# EAGLE schematic PLC_YN_CPU (EAGLE 9.6.2)

## Sheet 1 of 7: ETAPA DE ALIMENTACIÓN
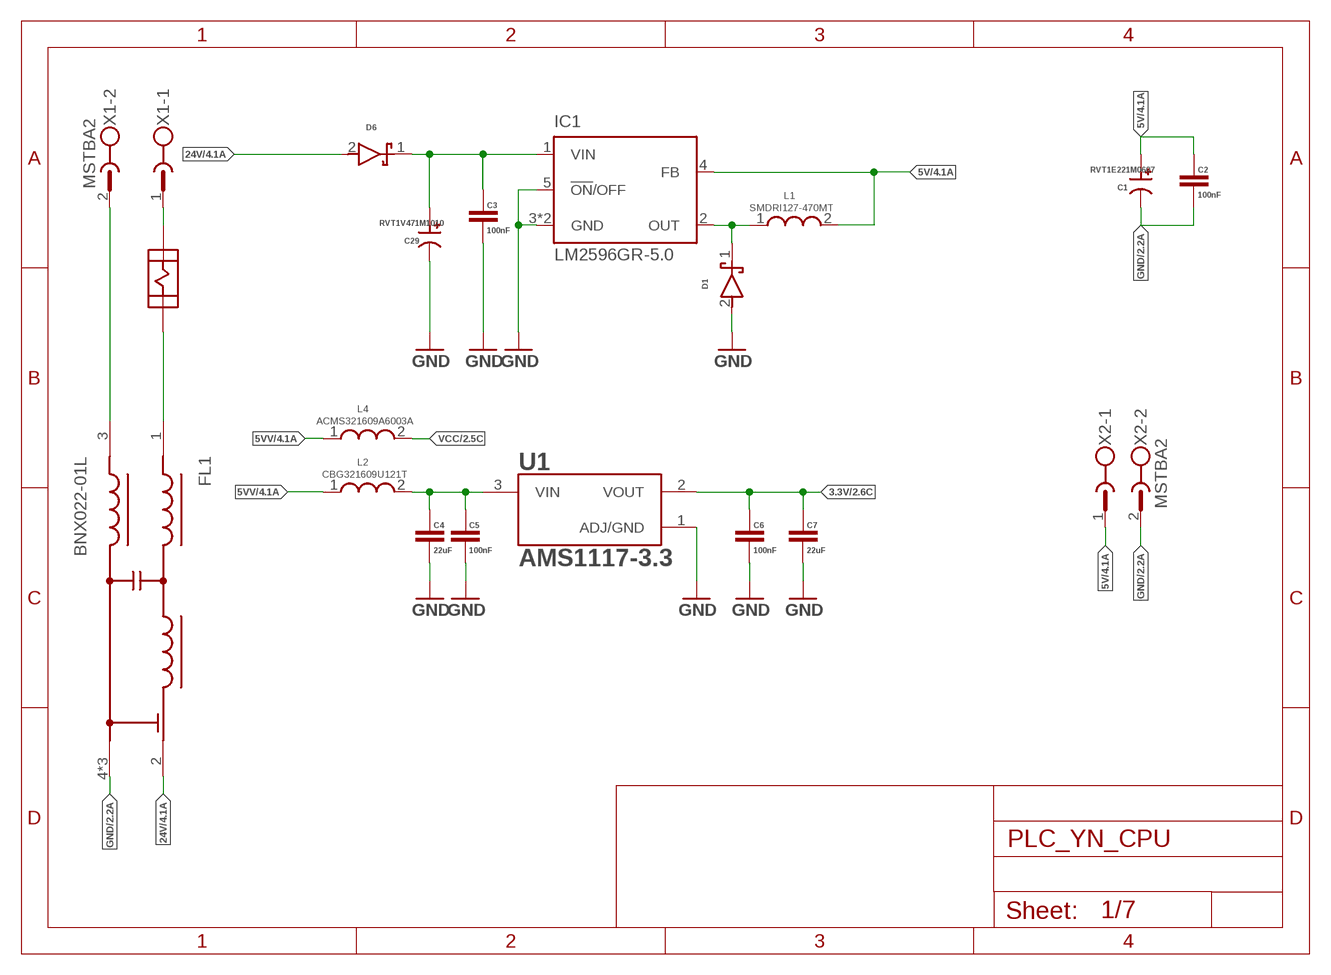
[diagram p0: schematic, sheet 1]

### Parts
C1  RVT1E221M0607  100UF_6.3X7.7_SMD  [CAP_100UF_6.3X7.7SMD]
C2  100nF  CAP_0603C0603  [C0603]
C3  100nF  CAP_0603C0603  [C0603]
C4  22uF  CAP_1206  [SMD_1206]
C5  100nF  CAP_0603C0603  [C0603]
C6  100nF  CAP_0603C0603  [C0603]
C7  22uF  CAP_1206  [SMD_1206]
C29  RVT1V471M1010  470UF_10X10.2_SMD  [CAP_470UF_SMD_10X10.2]
D1  SS36F  B360B-13-F  [B360]
D6  SS56  B360B-13-F  [B360]
F2  3A  PORTAFUSIBLE  [PORTAFUSIBLE]
FL1  BNX022-01L  [FIL_BNX022-01L]
IC1  LM2596GR-5.0  LM2596S  [TO263-5]
L1  SMDRI127-470MT  INDUCTOR_SMD  [IND]
L2  CBG321609U121T  FERRITA_SMD_1206  [SMD_1206]
L4  ACMS321609A6003A  FERRITA_SMD_1206  [SMD_1206]
U1  AMS1117-3.3  [SOT229P700X180-4N]
X1  MSTBA2  [MSTBA2]
X2  MSTBA2  [MSTBA2]

### Nets
3.3V: C6.1 C7.1 U1.2(VOUT) ; also sheet 2,5
5V: C1.P C2.1 IC1.4(FB) L1.2 X2.1 ; also sheet 4
5VV: L2.1 L4.1 ; also sheet 4
24V: D6.2 FL1.2(CB) ; also sheet 4
GND: C1.N C2.2 C3.2 C4.2 C5.2 C6.2 C7.2 C29.N D1.2 FL1.4(CG) FL1.5(CG) FL1.6(CG) IC1.3(GND) IC1.5(!ON!/OFF) IC1.6(GND) U1.1(ADJ/GND) X2.2 ; also sheet 2,3,4,5,6,7
N$1: C4.1 C5.1 L2.2 U1.3(VIN)
N$4: C3.1 C29.P D6.1 IC1.1(VIN)
N$7: D1.1 IC1.2(OUT) L1.1
N$23: F2.P$2 F2.P$4 X1.1
N$29: FL1.3(PSG) X1.2
N$39: F2.P$1 F2.P$3 FL1.1(B)
VCC: L4.2 ; also sheet 2,3,7

## Sheet 2 of 7: MCU STM32F446
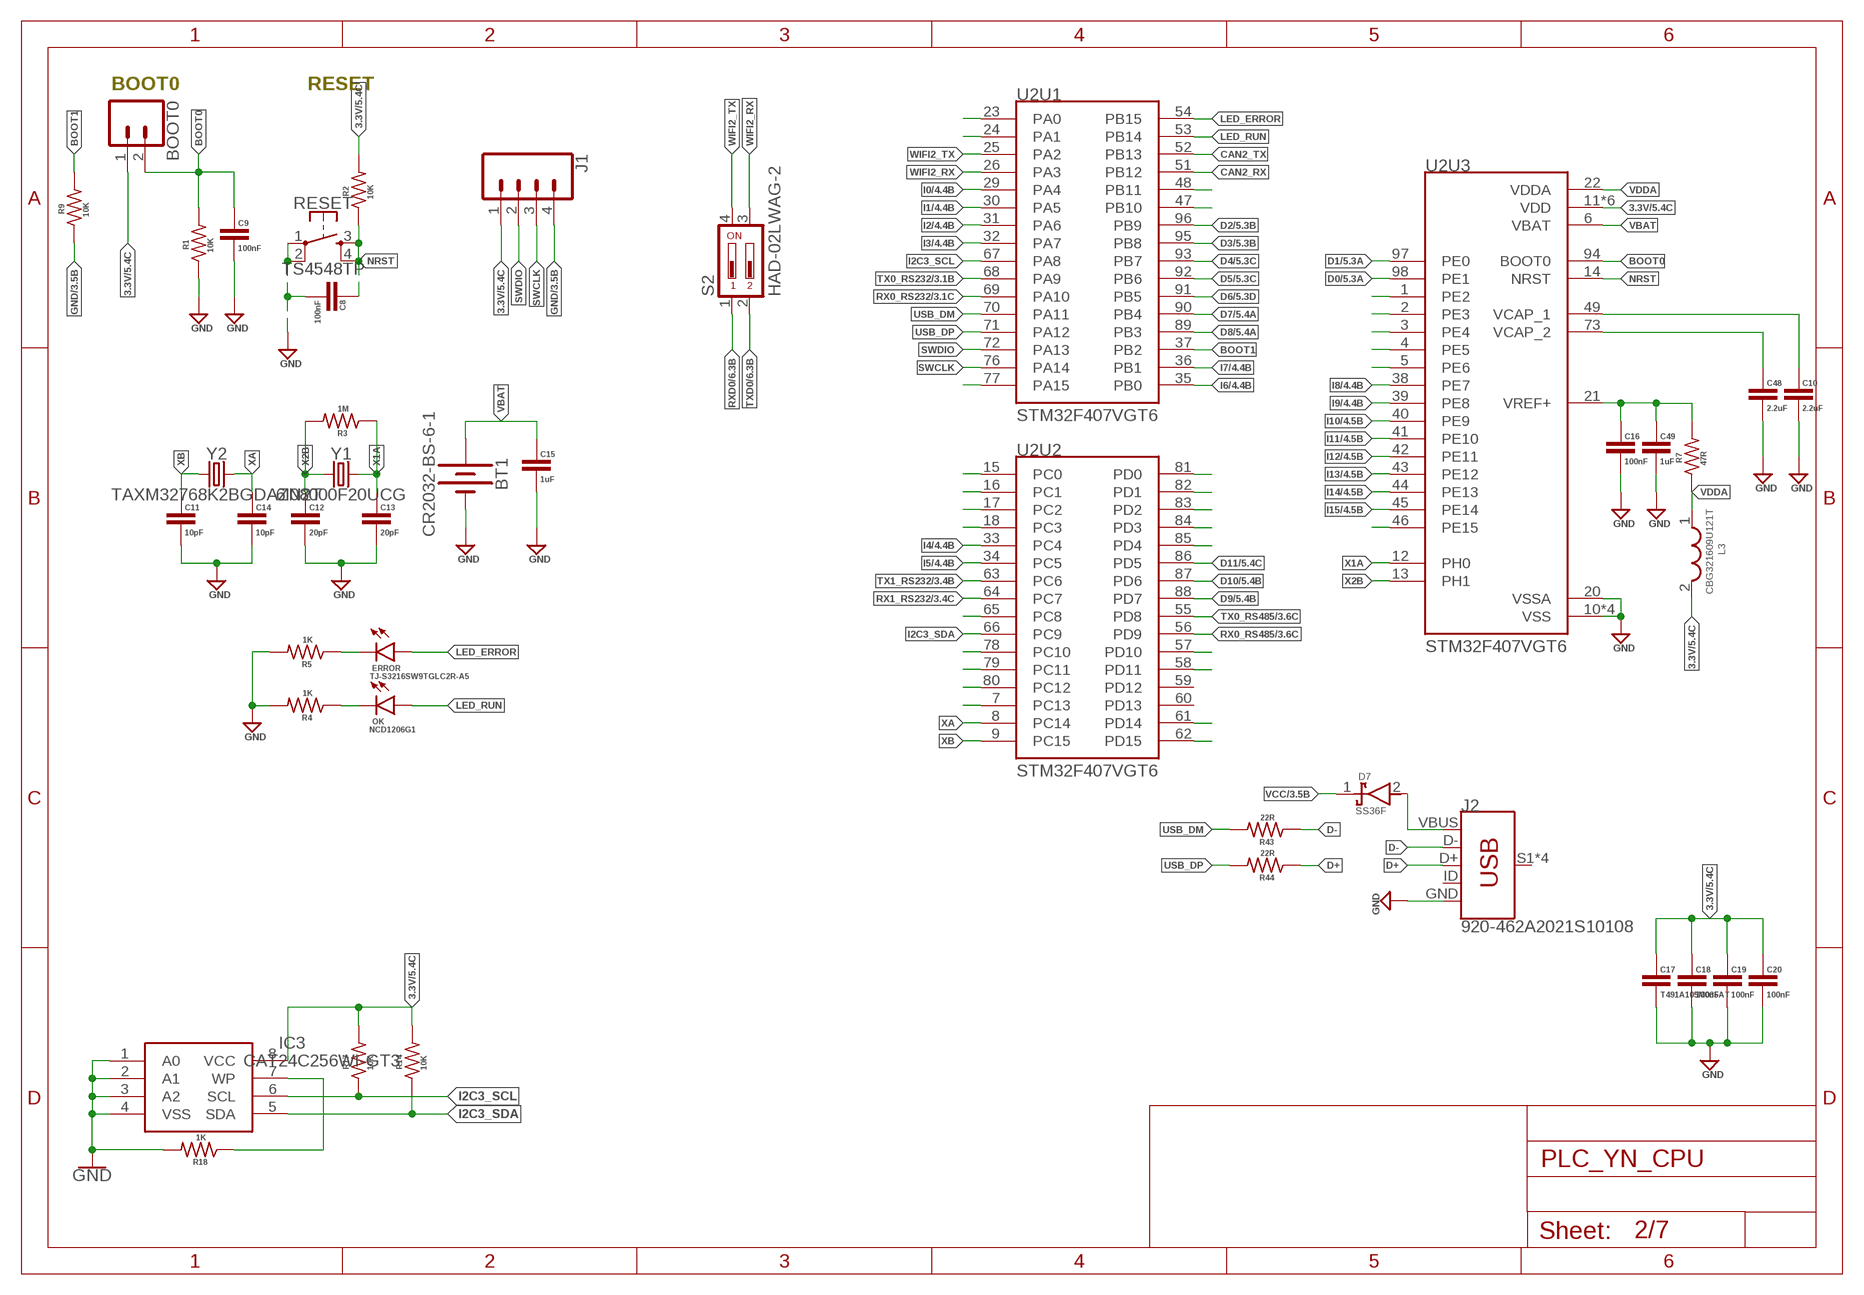
[diagram p1: schematic, sheet 2]

### Parts
BOOT0  CONN_02  [1X02]
BT1  CR2032-BS-6-1  BATTERY  [BAT_CR2032_SMD]
C8  100nF  CAP_0603C0603  [C0603]
C9  100nF  CAP_0603C0603  [C0603]
C10  2.2uF  CAP_0603C0603  [C0603]
C11  10pF  CAP_0603C0603  [C0603]
C12  20pF  CAP_0603C0603  [C0603]
C13  20pF  CAP_0603C0603  [C0603]
C14  10pF  CAP_0603C0603  [C0603]
C15  1uF  CAP_1206  [SMD_1206]
C16  100nF  CAP_0603C0603  [C0603]
C17  T491A105M035AT  CAP_1206  [SMD_1206]
C18  100nF  CAP_0603C0603  [C0603]
C19  100nF  CAP_0603C0603  [C0603]
C20  100nF  CAP_0603C0603  [C0603]
C48  2.2uF  CAP_0603C0603  [C0603]
C49  1uF  CAP_0603C0603  [C0603]
D7  SS36F  B360B-13-F  [B360]
ERROR  TJ-S3216SW9TGLC2R-A5  LEDSMT1206  [L1206]
IC3  CAT24C256WI-GT3  EEPROM-I2CSMD  [SO08]
J1  CONN_04  [1X04]
J2  920-462A2021S10108  USB_MINI-B_SMT  [USB-MINIB]
L3  CBG321609U121T  FERRITA_SMD_1206  [SMD_1206]
OK  NCD1206G1  LEDSMT1206  [L1206]
R1  10K  RES_0603R0603  [R0603]
R2  10K  RES_0603R0603  [R0603]
R3  1M  RES_0603R0603  [R0603]
R4  1K  RES_0603R0603  [R0603]
R5  1K  RES_0603R0603  [R0603]
R7  47R  RES_0603R0603  [R0603]
R9  10K  RES_0603R0603  [R0603]
R14  10K  RES_0603R0603  [R0603]
R17  10K  RES_0603R0603  [R0603]
R18  1K  RES_0603R0603  [R0603]
R43  22R  RES_0603R0603  [R0603]
R44  22R  RES_0603R0603  [R0603]
RESET  TS4548TP  PULSADOR-SMD-5.2MM  [SWITCH]
S2  HAD-02LWAG-2  219-02  [CTS-219-02]
U2  STM32F407VGT6  [QFP50P1600X1600X160-100N]
Y1  6I08000F20UCG  CRYSTALSMD-5X3.2-2PAD  [CRYSTAL-SMD-5X3.2-2PAD]
Y2  TAXM32768K2BGDAZN2T  CRYSTALSMD-2X6  [CRYSTAL-SMD-2X6-CYL]

### Nets
3.3V: BOOT0.1 C17.1 C18.1 C19.1 C20.1 IC3.8(VCC) J1.1 L3.2 R2.2 R14.2 R17.2 U2.11(U3:VDD) U2.19(U3:VDD) U2.28(U3:VDD) U2.50(U3:VDD) U2.75(U3:VDD) U2.100(U3:VDD) ; also sheet 1,5
BOOT0: BOOT0.2 C9.1 R1.2 U2.94(U3:BOOT0)
BOOT1: R9.2 U2.37(U1:PB2)
CAN2_RX: U2.51(U1:PB12)
CAN2_TX: U2.52(U1:PB13)
D0: U2.98(U3:PE1) ; also sheet 5
D1: U2.97(U3:PE0) ; also sheet 5
D2: U2.96(U1:PB9) ; also sheet 5
D3: U2.95(U1:PB8) ; also sheet 5
D4: U2.93(U1:PB7) ; also sheet 5
D5: U2.92(U1:PB6) ; also sheet 5
D6: U2.91(U1:PB5) ; also sheet 5
D7: U2.90(U1:PB4) ; also sheet 5
D8: U2.89(U1:PB3) ; also sheet 5
D9: U2.88(U2:PD7) ; also sheet 5
D10: U2.87(U2:PD6) ; also sheet 5
D11: U2.86(U2:PD5) ; also sheet 5
D+: J2.D+ R44.1
D-: J2.D- R43.1
GND: BT1.N(-) C8.2 C9.2 C10.2 C11.2 C12.2 C13.2 C14.2 C15.2 C16.2 C17.2 C18.2 C19.2 C20.2 C48.2 C49.2 IC3.1(A0) IC3.2(A1) IC3.3(A2) IC3.4(VSS) J1.4 J2.GND R1.1 R4.2 R5.2 R9.1 R18.2 RESET.1 RESET.2 U2.10(U3:VSS) U2.20(U3:VSSA) U2.27(U3:VSS) U2.74(U3:VSS) U2.99(U3:VSS) ; also sheet 1,3,4,5,6,7
I0: U2.29(U1:PA4) ; also sheet 4
I1: U2.30(U1:PA5) ; also sheet 4
I2: U2.31(U1:PA6) ; also sheet 4
I2C3_SCL: IC3.6(SCL) R17.1 U2.67(U1:PA8)
I2C3_SDA: IC3.5(SDA) R14.1 U2.66(U2:PC9)
I3: U2.32(U1:PA7) ; also sheet 4
I4: U2.33(U2:PC4) ; also sheet 4
I5: U2.34(U2:PC5) ; also sheet 4
I6: U2.35(U1:PB0) ; also sheet 4
I7: U2.36(U1:PB1) ; also sheet 4
I8: U2.38(U3:PE7) ; also sheet 4
I9: U2.39(U3:PE8) ; also sheet 4
I10: U2.40(U3:PE9) ; also sheet 4
I11: U2.41(U3:PE10) ; also sheet 4
I12: U2.42(U3:PE11) ; also sheet 4
I13: U2.43(U3:PE12) ; also sheet 4
I14: U2.44(U3:PE13) ; also sheet 4
I15: U2.45(U3:PE14) ; also sheet 4
LED_ERROR: ERROR.A U2.54(U1:PB15)
LED_RUN: OK.A U2.53(U1:PB14)
N$3: C10.1 U2.49(U3:VCAP_1)
N$22: C48.1 U2.73(U3:VCAP_2)
N$28: C16.1 C49.1 R7.2 U2.21(U3:VREF+)
N$34: D7.2 J2.VBUS
N$46: IC3.7(WP) R18.1
N$48: ERROR.C R5.1
N$49: OK.C R4.1
N$172: U2.23(U1:PA0)
N$173: U2.24(U1:PA1)
N$189: U2.77(U1:PA15)
N$200: U2.47(U1:PB10)
N$201: U2.48(U1:PB11)
N$206: U2.15(U2:PC0)
N$207: U2.16(U2:PC1)
N$208: U2.17(U2:PC2)
N$209: U2.18(U2:PC3)
N$214: U2.65(U2:PC8)
N$216: U2.78(U2:PC10)
N$217: U2.79(U2:PC11)
N$218: U2.80(U2:PC12)
N$219: U2.7(U2:PC13)
N$222: U2.81(U2:PD0)
N$223: U2.82(U2:PD1)
N$224: U2.83(U2:PD2)
N$225: U2.84(U2:PD3)
N$226: U2.85(U2:PD4)
N$232: U2.57(U2:PD10)
N$233: U2.58(U2:PD11)
N$236: U2.61(U2:PD14)
N$237: U2.62(U2:PD15)
N$240: U2.1(U3:PE2)
N$241: U2.2(U3:PE3)
N$242: U2.3(U3:PE4)
N$243: U2.4(U3:PE5)
N$244: U2.5(U3:PE6)
N$253: U2.46(U3:PE15)
NRST: C8.1 R2.1 RESET.3 RESET.4 U2.14(U3:NRST)
RX0_RS232: U2.69(U1:PA10) ; also sheet 3
RX0_RS485: U2.56(U2:PD9) ; also sheet 3
RX1_RS232: U2.64(U2:PC7) ; also sheet 3
RXD0: S2.1 ; also sheet 6
SWCLK: J1.3 U2.76(U1:PA14)
SWDIO: J1.2 U2.72(U1:PA13)
TX0_RS232: U2.68(U1:PA9) ; also sheet 3
TX0_RS485: U2.55(U2:PD8) ; also sheet 3
TX1_RS232: U2.63(U2:PC6) ; also sheet 3
TXD0: S2.2 ; also sheet 6
USB_DM: R43.2 U2.70(U1:PA11)
USB_DP: R44.2 U2.71(U1:PA12)
VBAT: BT1.P(+) C15.1 U2.6(U3:VBAT)
VCC: D7.1 ; also sheet 1,3,7
VDDA: L3.1 R7.1 U2.22(U3:VDDA)
WIFI2_RX: S2.3 U2.26(U1:PA3)
WIFI2_TX: S2.4 U2.25(U1:PA2)
X1A: C13.1 R3.1 U2.12(U3:PH0) Y1.P$2
X2B: C12.1 R3.2 U2.13(U3:PH1) Y1.P$1
XA: C14.1 U2.8(U2:PC14) Y2.X2
XB: C11.1 U2.9(U2:PC15) Y2.X1
Unconnected: J2.ID J2.S1(SHIELD) J2.S2(SHIELD) J2.S3(SHIELD) J2.S4(SHIELD) U2.59(U2:PD12) U2.60(U2:PD13)

### Notes on the sheet
- BOOT0 | RESET

## Sheet 3 of 7: COMUNICACION
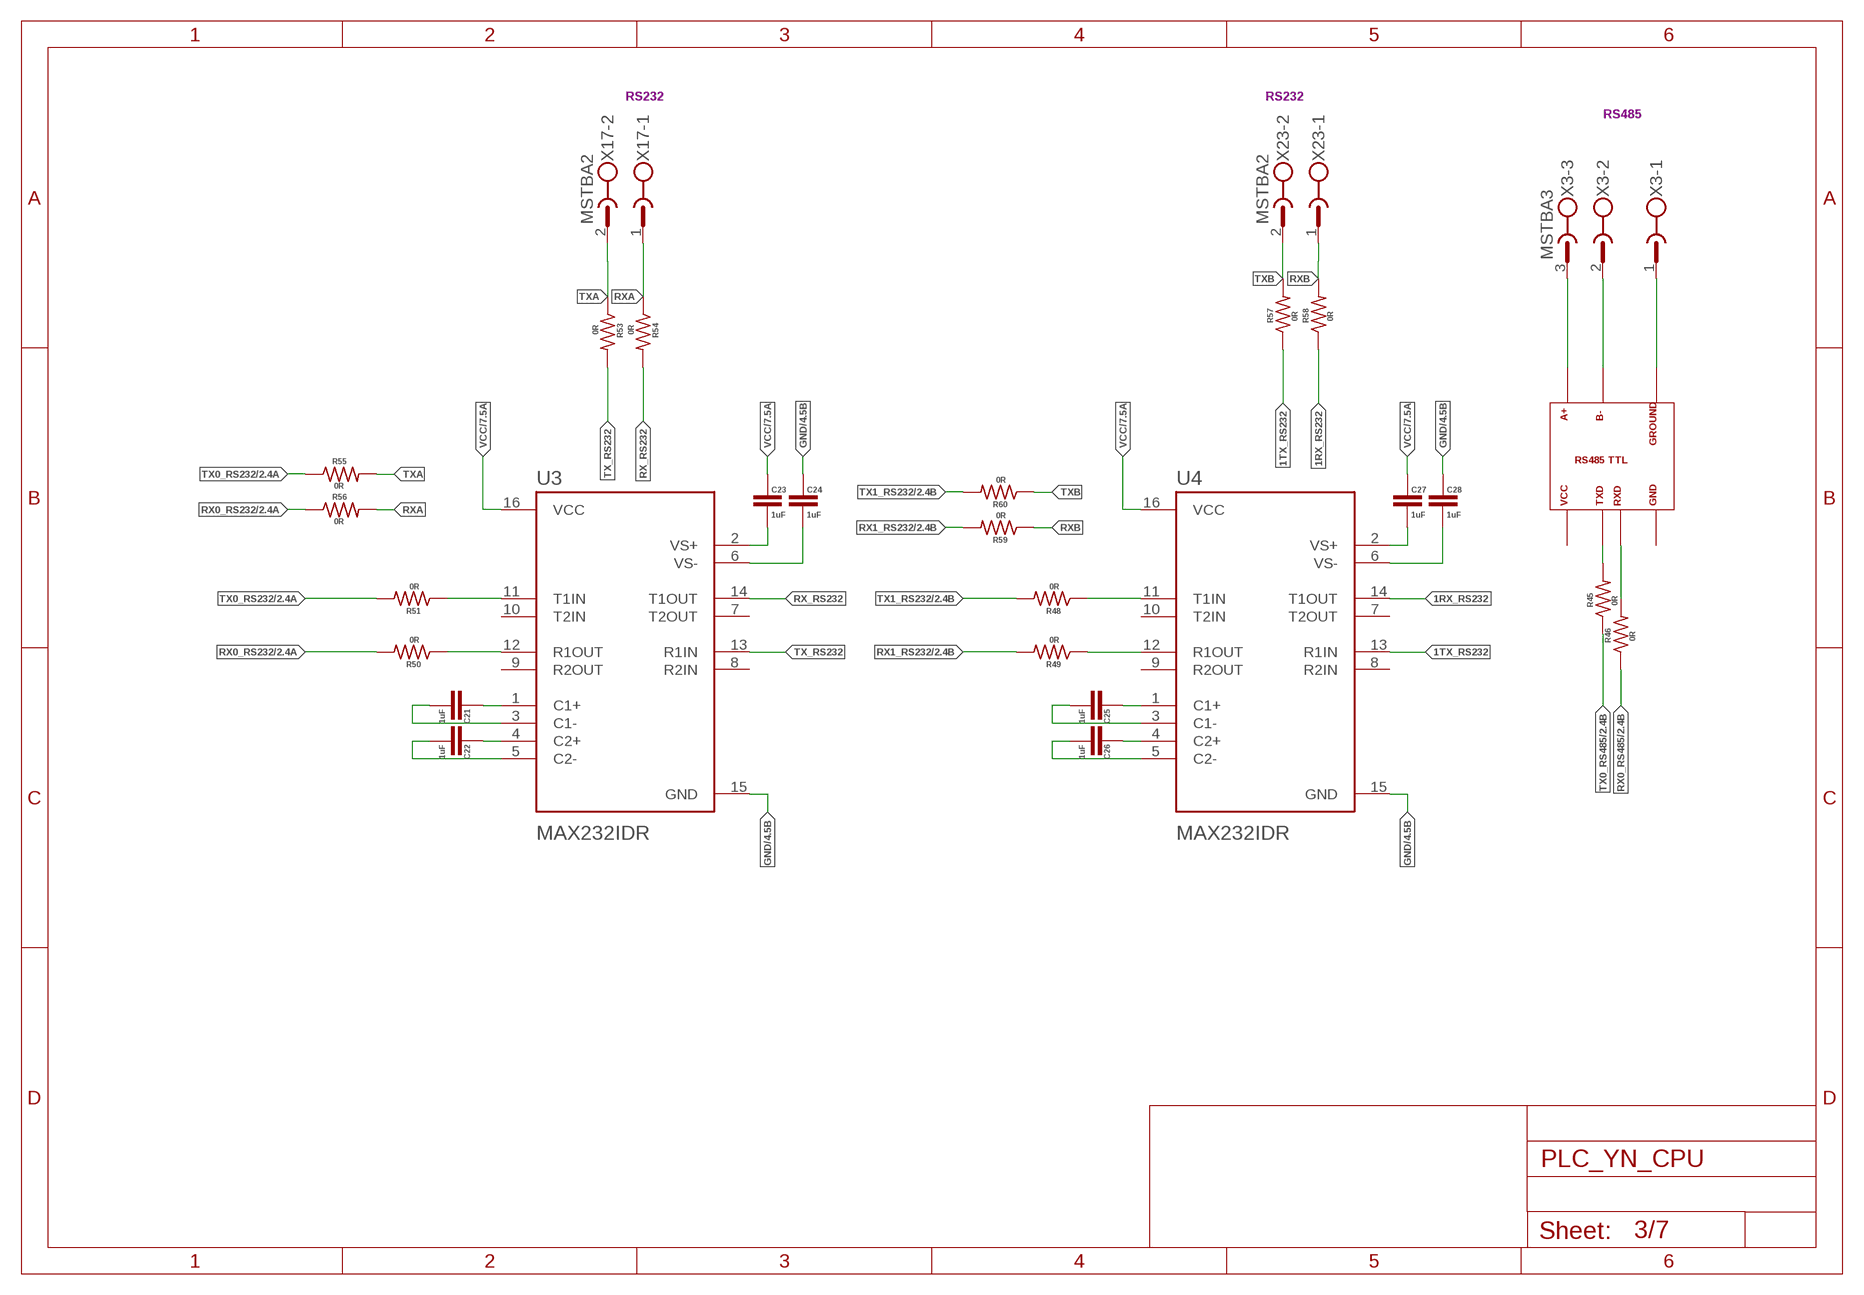
[diagram p2: schematic, sheet 3]

### Parts
C21  1uF  CAP_0603C0603  [C0603]
C22  1uF  CAP_0603C0603  [C0603]
C23  1uF  CAP_0603C0603  [C0603]
C24  1uF  CAP_0603C0603  [C0603]
C25  1uF  CAP_0603C0603  [C0603]
C26  1uF  CAP_0603C0603  [C0603]
C27  1uF  CAP_0603C0603  [C0603]
C28  1uF  CAP_0603C0603  [C0603]
R45  0R  RES_0603R0603  [R0603]
R46  0R  RES_0603R0603  [R0603]
R48  0R  RES_0603R0603  [R0603]
R49  0R  RES_0603R0603  [R0603]
R50  0R  RES_0603R0603  [R0603]
R51  0R  RES_0603R0603  [R0603]
R53  0R  RES_0603R0603  [R0603]
R54  0R  RES_0603R0603  [R0603]
R55  0R  RES_0603R0603  [R0603]
R56  0R  RES_0603R0603  [R0603]
R57  0R  RES_0603R0603  [R0603]
R58  0R  RES_0603R0603  [R0603]
R59  0R  RES_0603R0603  [R0603]
R60  0R  RES_0603R0603  [R0603]
U3  MAX232IDR  MAX232  [SOIC127P600X175-16N]
U4  MAX232IDR  MAX232  [SOIC127P600X175-16N]
U5  RS485  RS485TTL  [RS485TTL]
X3  MSTBA3  [MSTBA3]
X17  MSTBA2  [MSTBA2]
X23  MSTBA2  [MSTBA2]

### Nets
1RX_RS232: R58.1 U4.14(T1OUT)
1TX_RS232: R57.1 U4.13(R1IN)
GND: C24.1 C28.1 U3.15(GND) U4.15(GND) ; also sheet 1,2,4,5,6,7
N$5: U5.A+ X3.3
N$6: R45.2 U5.TXD
N$8: U5.B- X3.2
N$9: U5.GROUND X3.1
N$10: C21.1 U3.1(C1+)
N$11: C21.2 U3.3(C1-)
N$12: C22.1 U3.4(C2+)
N$13: C22.2 U3.5(C2-)
N$14: C25.1 U4.1(C1+)
N$15: C23.2 U3.2(VS+)
N$16: C24.2 U3.6(VS-)
N$17: C25.2 U4.3(C1-)
N$18: C26.1 U4.4(C2+)
N$19: C26.2 U4.5(C2-)
N$20: C27.2 U4.2(VS+)
N$21: C28.2 U4.6(VS-)
N$35: R46.2 U5.RXD
N$36: R48.1 U4.11(T1IN)
N$37: R49.1 U4.12(R1OUT)
N$40: R50.1 U3.12(R1OUT)
N$42: R51.1 U3.11(T1IN)
RX0_RS232: R50.2 R56.1 ; also sheet 2
RX0_RS485: R46.1 ; also sheet 2
RX1_RS232: R49.2 R59.2 ; also sheet 2
RX_RS232: R54.2 U3.14(T1OUT)
RXA: R54.1 R56.2 X17.1
RXB: R58.2 R59.1 X23.1
TX0_RS232: R51.2 R55.1 ; also sheet 2
TX0_RS485: R45.1 ; also sheet 2
TX1_RS232: R48.2 R60.2 ; also sheet 2
TX_RS232: R53.2 U3.13(R1IN)
TXA: R53.1 R55.2 X17.2
TXB: R57.2 R60.1 X23.2
VCC: C23.1 C27.1 U3.16(VCC) U4.16(VCC) ; also sheet 1,2,7
Unconnected: U3.7(T2OUT) U3.8(R2IN) U3.9(R2OUT) U3.10(T2IN) U4.7(T2OUT) U4.8(R2IN) U4.9(R2OUT) U4.10(T2IN)

### Notes on the sheet
- RS232 | RS232
- RS485

## Sheet 4 of 7: OUTPUT
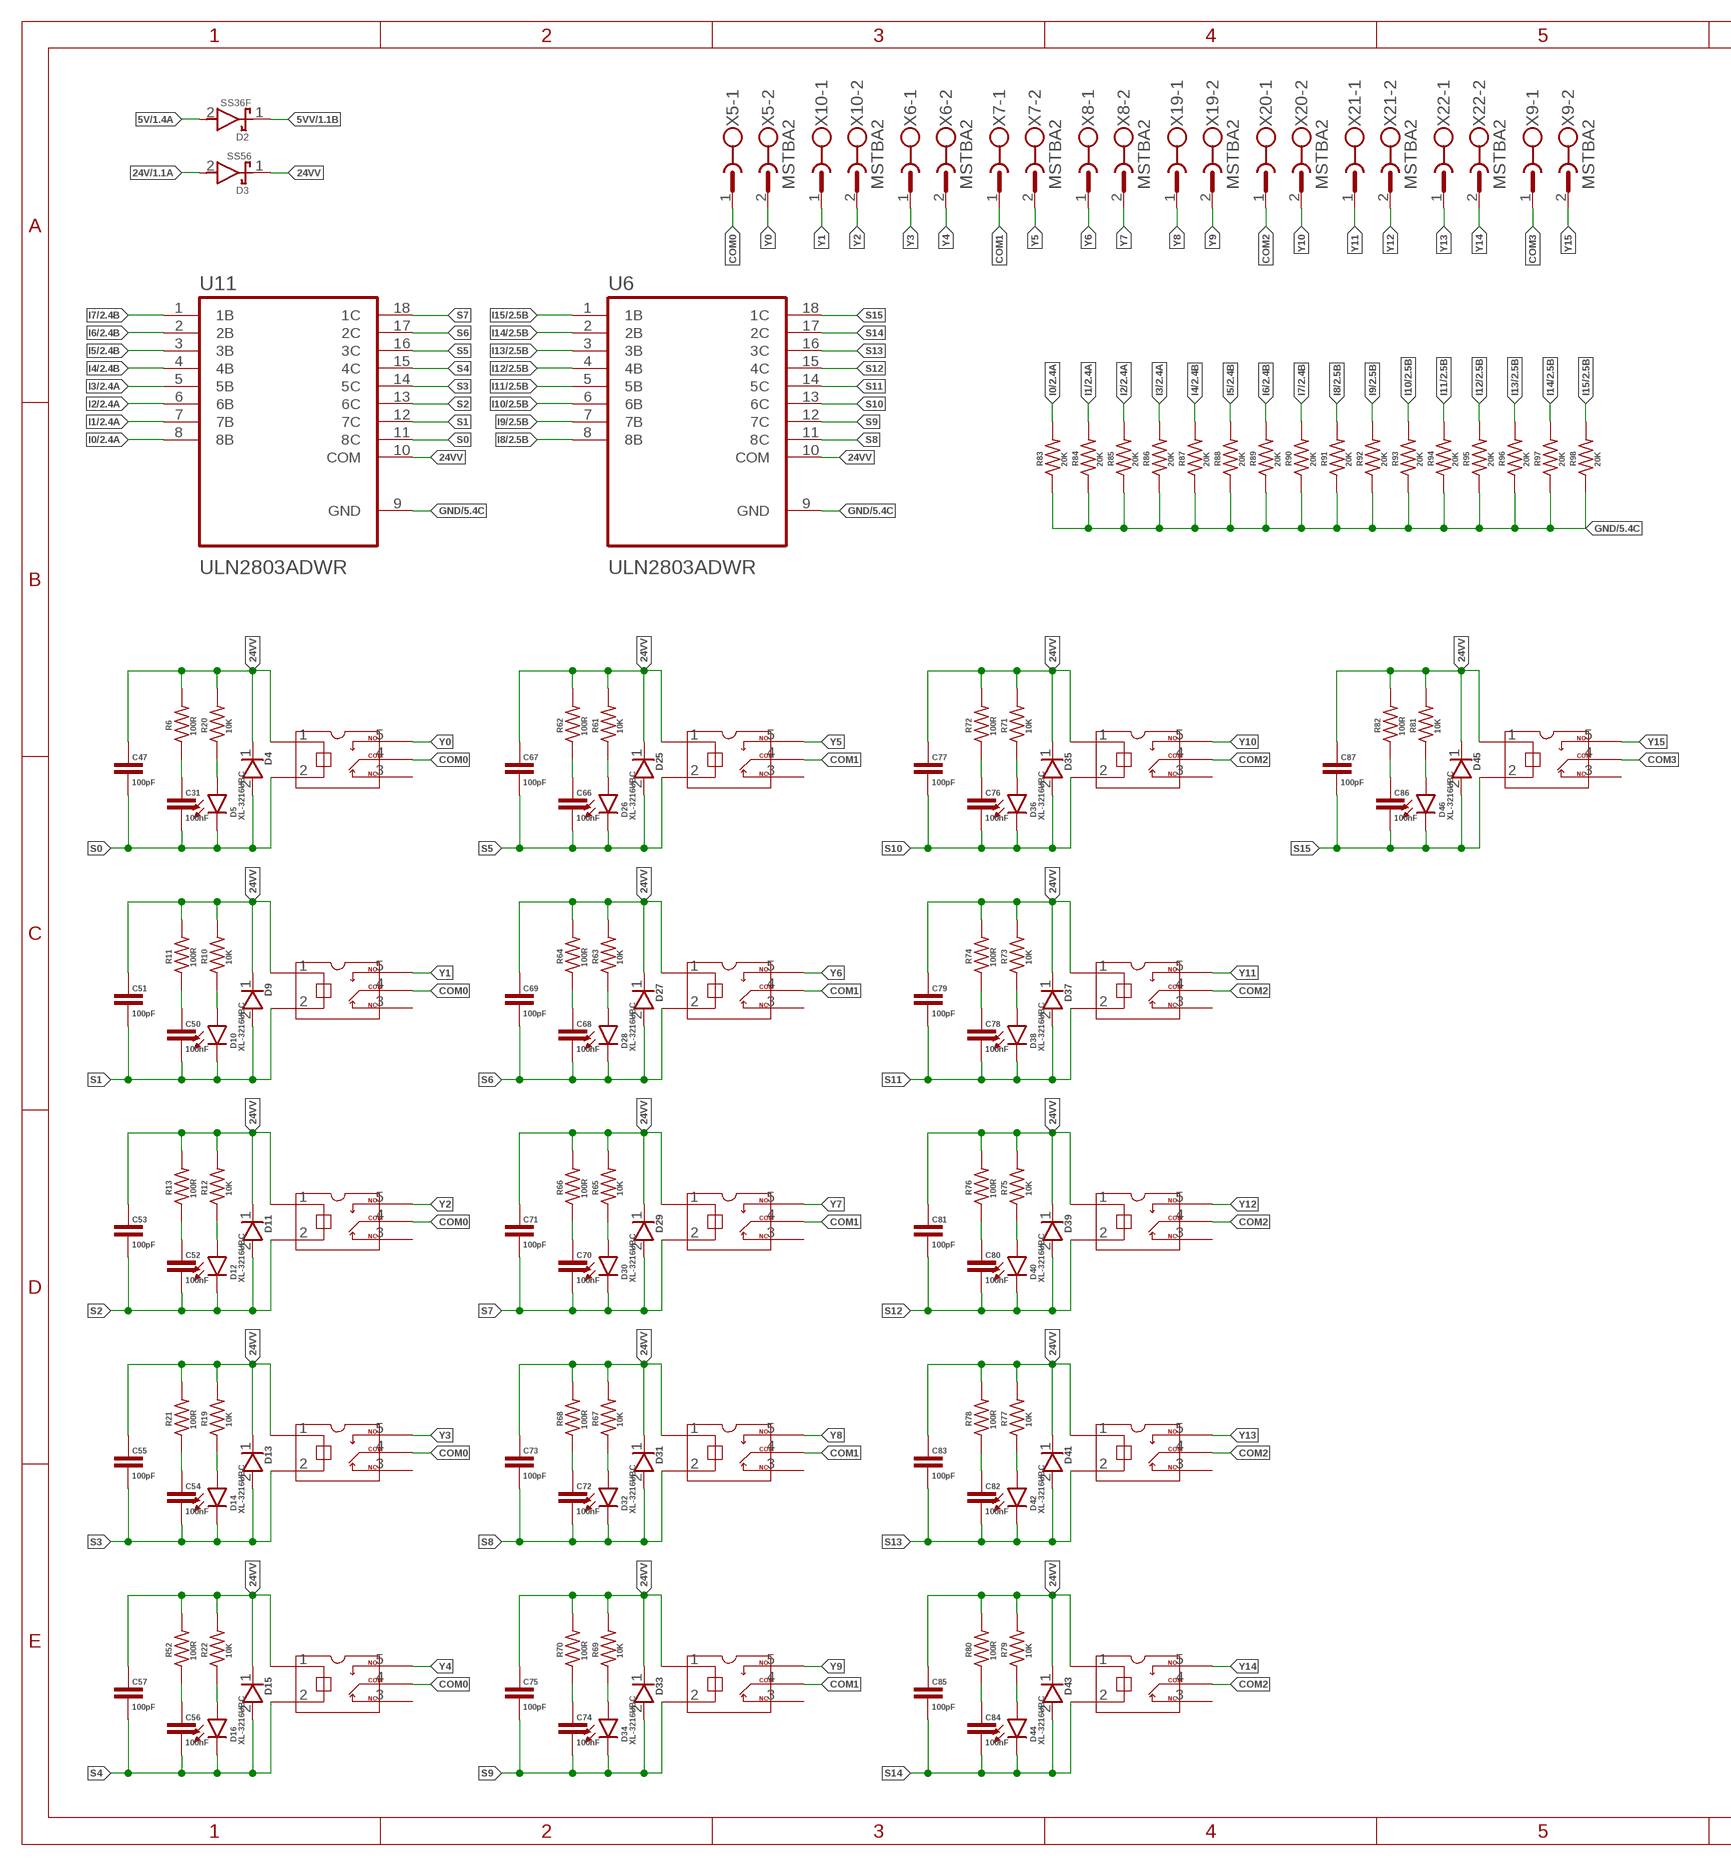
[diagram p3: schematic, sheet 4, part 1 of 2]
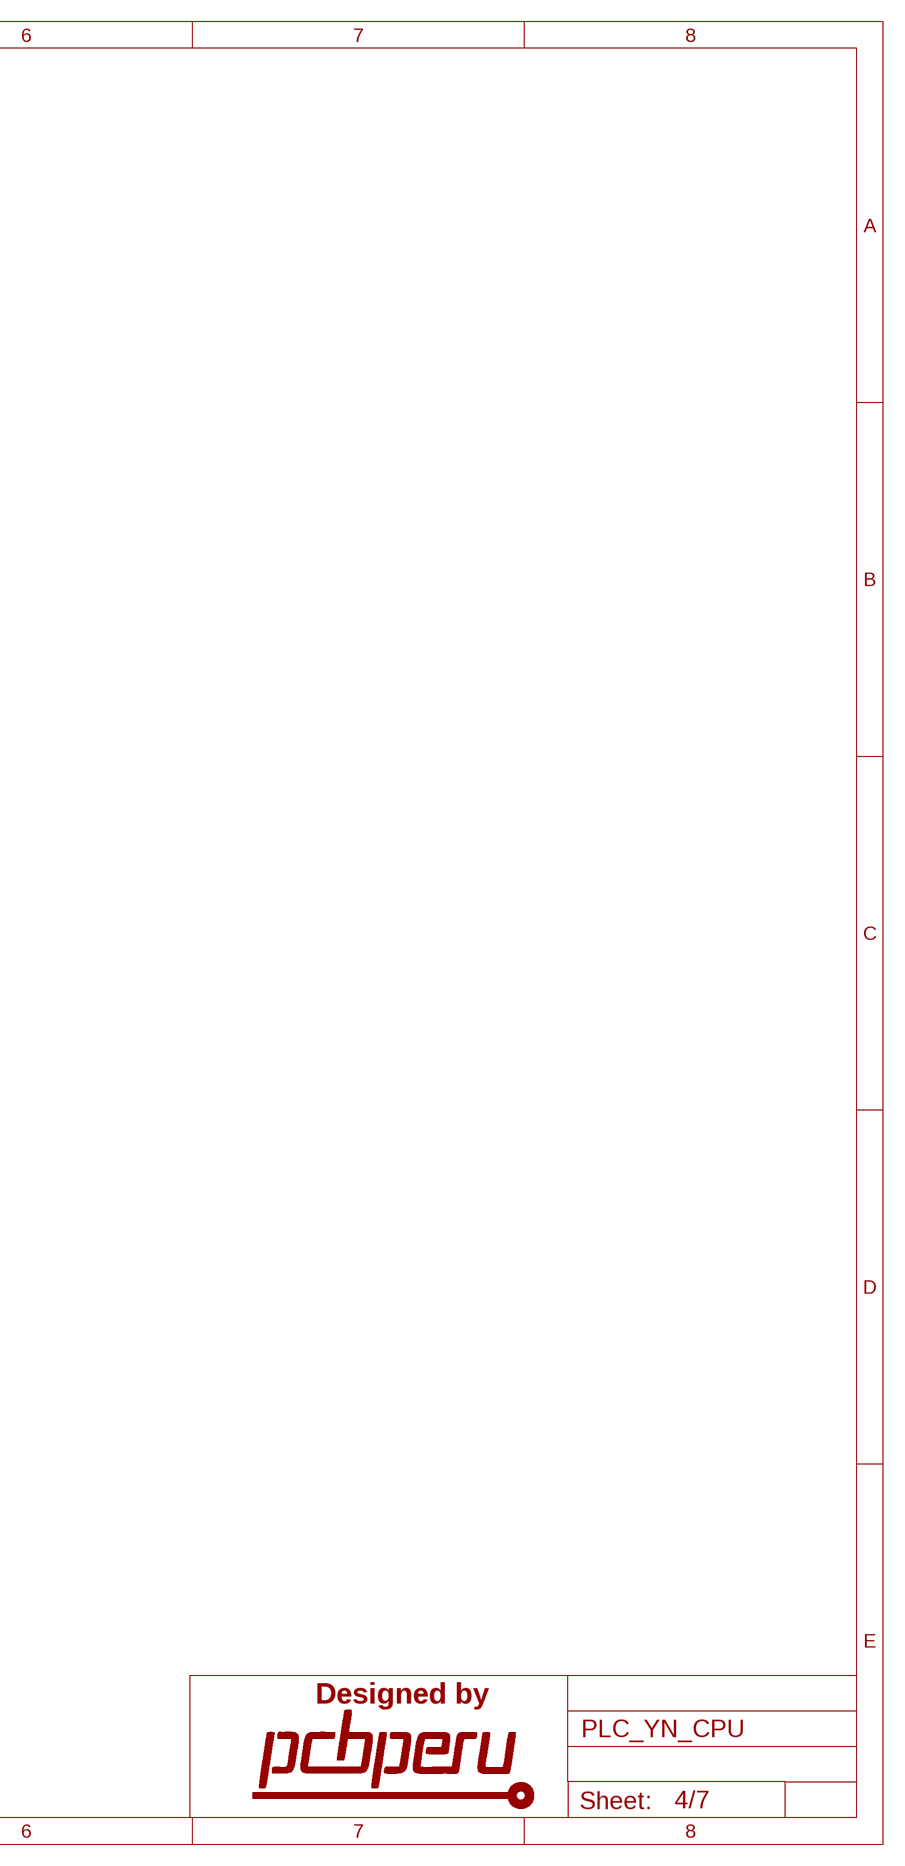
[diagram p4: schematic, sheet 4, part 2 of 2]

### Parts
C31  100nF  CAP_0603C0603  [C0603]
C47  100pF  CAP_0603C0603  [C0603]
C50  100nF  CAP_0603C0603  [C0603]
C51  100pF  CAP_0603C0603  [C0603]
C52  100nF  CAP_0603C0603  [C0603]
C53  100pF  CAP_0603C0603  [C0603]
C54  100nF  CAP_0603C0603  [C0603]
C55  100pF  CAP_0603C0603  [C0603]
C56  100nF  CAP_0603C0603  [C0603]
C57  100pF  CAP_0603C0603  [C0603]
C66  100nF  CAP_0603C0603  [C0603]
C67  100pF  CAP_0603C0603  [C0603]
C68  100nF  CAP_0603C0603  [C0603]
C69  100pF  CAP_0603C0603  [C0603]
C70  100nF  CAP_0603C0603  [C0603]
C71  100pF  CAP_0603C0603  [C0603]
C72  100nF  CAP_0603C0603  [C0603]
C73  100pF  CAP_0603C0603  [C0603]
C74  100nF  CAP_0603C0603  [C0603]
C75  100pF  CAP_0603C0603  [C0603]
C76  100nF  CAP_0603C0603  [C0603]
C77  100pF  CAP_0603C0603  [C0603]
C78  100nF  CAP_0603C0603  [C0603]
C79  100pF  CAP_0603C0603  [C0603]
C80  100nF  CAP_0603C0603  [C0603]
C81  100pF  CAP_0603C0603  [C0603]
C82  100nF  CAP_0603C0603  [C0603]
C83  100pF  CAP_0603C0603  [C0603]
C84  100nF  CAP_0603C0603  [C0603]
C85  100pF  CAP_0603C0603  [C0603]
C86  100nF  CAP_0603C0603  [C0603]
C87  100pF  CAP_0603C0603  [C0603]
D2  SS36F  B360B-13-F  [B360]
D3  SS56  B360B-13-F  [B360]
D4  1N4148W-13-F  [SOD3716X145N]
D5  XL-3216UBC  LEDSMT1206  [L1206]
D9  1N4148W-13-F  [SOD3716X145N]
D10  XL-3216UBC  LEDSMT1206  [L1206]
D11  1N4148W-13-F  [SOD3716X145N]
D12  XL-3216UBC  LEDSMT1206  [L1206]
D13  1N4148W-13-F  [SOD3716X145N]
D14  XL-3216UBC  LEDSMT1206  [L1206]
D15  1N4148W-13-F  [SOD3716X145N]
D16  XL-3216UBC  LEDSMT1206  [L1206]
D25  1N4148W-13-F  [SOD3716X145N]
D26  XL-3216UBC  LEDSMT1206  [L1206]
D27  1N4148W-13-F  [SOD3716X145N]
D28  XL-3216UBC  LEDSMT1206  [L1206]
D29  1N4148W-13-F  [SOD3716X145N]
D30  XL-3216UBC  LEDSMT1206  [L1206]
D31  1N4148W-13-F  [SOD3716X145N]
D32  XL-3216UBC  LEDSMT1206  [L1206]
D33  1N4148W-13-F  [SOD3716X145N]
D34  XL-3216UBC  LEDSMT1206  [L1206]
D35  1N4148W-13-F  [SOD3716X145N]
D36  XL-3216UBC  LEDSMT1206  [L1206]
D37  1N4148W-13-F  [SOD3716X145N]
D38  XL-3216UBC  LEDSMT1206  [L1206]
D39  1N4148W-13-F  [SOD3716X145N]
D40  XL-3216UBC  LEDSMT1206  [L1206]
D41  1N4148W-13-F  [SOD3716X145N]
D42  XL-3216UBC  LEDSMT1206  [L1206]
D43  1N4148W-13-F  [SOD3716X145N]
D44  XL-3216UBC  LEDSMT1206  [L1206]
D45  1N4148W-13-F  [SOD3716X145N]
D46  XL-3216UBC  LEDSMT1206  [L1206]
R6  100R  RES_0603R0603  [R0603]
R10  10K  RES_0603R0603  [R0603]
R11  100R  RES_0603R0603  [R0603]
R12  10K  RES_0603R0603  [R0603]
R13  100R  RES_0603R0603  [R0603]
R19  10K  RES_0603R0603  [R0603]
R20  10K  RES_0603R0603  [R0603]
R21  100R  RES_0603R0603  [R0603]
R22  10K  RES_0603R0603  [R0603]
R52  100R  RES_0603R0603  [R0603]
R61  10K  RES_0603R0603  [R0603]
R62  100R  RES_0603R0603  [R0603]
R63  10K  RES_0603R0603  [R0603]
R64  100R  RES_0603R0603  [R0603]
R65  10K  RES_0603R0603  [R0603]
R66  100R  RES_0603R0603  [R0603]
R67  10K  RES_0603R0603  [R0603]
R68  100R  RES_0603R0603  [R0603]
R69  10K  RES_0603R0603  [R0603]
R70  100R  RES_0603R0603  [R0603]
R71  10K  RES_0603R0603  [R0603]
R72  100R  RES_0603R0603  [R0603]
R73  10K  RES_0603R0603  [R0603]
R74  100R  RES_0603R0603  [R0603]
R75  10K  RES_0603R0603  [R0603]
R76  100R  RES_0603R0603  [R0603]
R77  10K  RES_0603R0603  [R0603]
R78  100R  RES_0603R0603  [R0603]
R79  10K  RES_0603R0603  [R0603]
R80  100R  RES_0603R0603  [R0603]
R81  10K  RES_0603R0603  [R0603]
R82  100R  RES_0603R0603  [R0603]
R83  20K  RES_0603R0603  [R0603]
R84  20K  RES_0603R0603  [R0603]
R85  20K  RES_0603R0603  [R0603]
R86  20K  RES_0603R0603  [R0603]
R87  20K  RES_0603R0603  [R0603]
R88  20K  RES_0603R0603  [R0603]
R89  20K  RES_0603R0603  [R0603]
R90  20K  RES_0603R0603  [R0603]
R91  20K  RES_0603R0603  [R0603]
R92  20K  RES_0603R0603  [R0603]
R93  20K  RES_0603R0603  [R0603]
R94  20K  RES_0603R0603  [R0603]
R95  20K  RES_0603R0603  [R0603]
R96  20K  RES_0603R0603  [R0603]
R97  20K  RES_0603R0603  [R0603]
R98  20K  RES_0603R0603  [R0603]
RL1  HF41F  [HF41F]
RL3  HF41F  [HF41F]
RL4  HF41F  [HF41F]
RL5  HF41F  [HF41F]
RL6  HF41F  [HF41F]
RL11  HF41F  [HF41F]
RL12  HF41F  [HF41F]
RL13  HF41F  [HF41F]
RL14  HF41F  [HF41F]
RL15  HF41F  [HF41F]
RL16  HF41F  [HF41F]
RL17  HF41F  [HF41F]
RL18  HF41F  [HF41F]
RL19  HF41F  [HF41F]
RL20  HF41F  [HF41F]
RL21  HF41F  [HF41F]
U6  ULN2803ADWR  ULN2803ADW  [SOIC127P1030X265-18N]
U11  ULN2803ADWR  ULN2803ADW  [SOIC127P1030X265-18N]
X5  MSTBA2  [MSTBA2]
X6  MSTBA2  [MSTBA2]
X7  MSTBA2  [MSTBA2]
X8  MSTBA2  [MSTBA2]
X9  MSTBA2  [MSTBA2]
X10  MSTBA2  [MSTBA2]
X19  MSTBA2  [MSTBA2]
X20  MSTBA2  [MSTBA2]
X21  MSTBA2  [MSTBA2]
X22  MSTBA2  [MSTBA2]

### Nets
5V: D2.2 ; also sheet 1
5VV: D2.1 ; also sheet 1
24V: D3.2 ; also sheet 1
24VV: C47.1 C51.1 C53.1 C55.1 C57.1 C67.1 C69.1 C71.1 C73.1 C75.1 C77.1 C79.1 C81.1 C83.1 C85.1 C87.1 D3.1 D4.1(K) D9.1(K) D11.1(K) D13.1(K) D15.1(K) D25.1(K) D27.1(K) D29.1(K) D31.1(K) D33.1(K) D35.1(K) D37.1(K) D39.1(K) D41.1(K) D43.1(K) D45.1(K) R6.2 R10.2 R11.2 R12.2 R13.2 R19.2 R20.2 R21.2 R22.2 R52.2 R61.2 R62.2 R63.2 R64.2 R65.2 R66.2 R67.2 R68.2 R69.2 R70.2 R71.2 R72.2 R73.2 R74.2 R75.2 R76.2 R77.2 R78.2 R79.2 R80.2 R81.2 R82.2 RL1.1 RL3.1 RL4.1 RL5.1 RL6.1 RL11.1 RL12.1 RL13.1 RL14.1 RL15.1 RL16.1 RL17.1 RL18.1 RL19.1 RL20.1 RL21.1 U6.10(COM) U11.10(COM)
COM0: RL1.4 RL3.4 RL4.4 RL5.4 RL6.4 X5.1
COM1: RL11.4 RL12.4 RL13.4 RL14.4 RL15.4 X7.1
COM2: RL16.4 RL17.4 RL18.4 RL19.4 RL20.4 X20.1
COM3: RL21.4 X9.1
GND: R83.1 R84.1 R85.1 R86.1 R87.1 R88.1 R89.1 R90.1 R91.1 R92.1 R93.1 R94.1 R95.1 R96.1 R97.1 R98.1 U6.9(GND) U11.9(GND) ; also sheet 1,2,3,5,6,7
I0: R83.2 U11.8(8B) ; also sheet 2
I1: R84.2 U11.7(7B) ; also sheet 2
I2: R85.2 U11.6(6B) ; also sheet 2
I3: R86.2 U11.5(5B) ; also sheet 2
I4: R87.2 U11.4(4B) ; also sheet 2
I5: R88.2 U11.3(3B) ; also sheet 2
I6: R89.2 U11.2(2B) ; also sheet 2
I7: R90.2 U11.1(1B) ; also sheet 2
I8: R91.2 U6.8(8B) ; also sheet 2
I9: R92.2 U6.7(7B) ; also sheet 2
I10: R93.2 U6.6(6B) ; also sheet 2
I11: R94.2 U6.5(5B) ; also sheet 2
I12: R95.2 U6.4(4B) ; also sheet 2
I13: R96.2 U6.3(3B) ; also sheet 2
I14: R97.2 U6.2(2B) ; also sheet 2
I15: R98.2 U6.1(1B) ; also sheet 2
N$26: C31.1 R6.1
N$44: D10.A R10.1
N$52: D5.A R20.1
N$69: C50.1 R11.1
N$70: D12.A R12.1
N$71: C52.1 R13.1
N$72: D14.A R19.1
N$73: C54.1 R21.1
N$74: D16.A R22.1
N$75: C56.1 R52.1
N$83: D26.A R61.1
N$84: C66.1 R62.1
N$85: D28.A R63.1
N$86: C68.1 R64.1
N$87: D30.A R65.1
N$88: C70.1 R66.1
N$89: D32.A R67.1
N$90: C72.1 R68.1
N$91: D34.A R69.1
N$92: C74.1 R70.1
N$93: D36.A R71.1
N$94: C76.1 R72.1
N$95: D38.A R73.1
N$96: C78.1 R74.1
N$97: D40.A R75.1
N$98: C80.1 R76.1
N$99: D42.A R77.1
N$100: C82.1 R78.1
N$101: D44.A R79.1
N$102: C84.1 R80.1
N$103: D46.A R81.1
N$104: C86.1 R82.1
S0: C31.2 C47.2 D4.2(A) D5.C RL1.2 U11.11(8C)
S1: C50.2 C51.2 D9.2(A) D10.C RL3.2 U11.12(7C)
S2: C52.2 C53.2 D11.2(A) D12.C RL4.2 U11.13(6C)
S3: C54.2 C55.2 D13.2(A) D14.C RL5.2 U11.14(5C)
S4: C56.2 C57.2 D15.2(A) D16.C RL6.2 U11.15(4C)
S5: C66.2 C67.2 D25.2(A) D26.C RL11.2 U11.16(3C)
S6: C68.2 C69.2 D27.2(A) D28.C RL12.2 U11.17(2C)
S7: C70.2 C71.2 D29.2(A) D30.C RL13.2 U11.18(1C)
S8: C72.2 C73.2 D31.2(A) D32.C RL14.2 U6.11(8C)
S9: C74.2 C75.2 D33.2(A) D34.C RL15.2 U6.12(7C)
S10: C76.2 C77.2 D35.2(A) D36.C RL16.2 U6.13(6C)
S11: C78.2 C79.2 D37.2(A) D38.C RL17.2 U6.14(5C)
S12: C80.2 C81.2 D39.2(A) D40.C RL18.2 U6.15(4C)
S13: C82.2 C83.2 D41.2(A) D42.C RL19.2 U6.16(3C)
S14: C84.2 C85.2 D43.2(A) D44.C RL20.2 U6.17(2C)
S15: C86.2 C87.2 D45.2(A) D46.C RL21.2 U6.18(1C)
Y0: RL1.5 X5.2
Y1: RL3.5 X10.1
Y2: RL4.5 X10.2
Y3: RL5.5 X6.1
Y4: RL6.5 X6.2
Y5: RL11.5 X7.2
Y6: RL12.5 X8.1
Y7: RL13.5 X8.2
Y8: RL14.5 X19.1
Y9: RL15.5 X19.2
Y10: RL16.5 X20.2
Y11: RL17.5 X21.1
Y12: RL18.5 X21.2
Y13: RL19.5 X22.1
Y14: RL20.5 X22.2
Y15: RL21.5 X9.2
Unconnected: RL1.3 RL3.3 RL4.3 RL5.3 RL6.3 RL11.3 RL12.3 RL13.3 RL14.3 RL15.3 RL16.3 RL17.3 RL18.3 RL19.3 RL20.3 RL21.3

## Sheet 5 of 7: INPUT
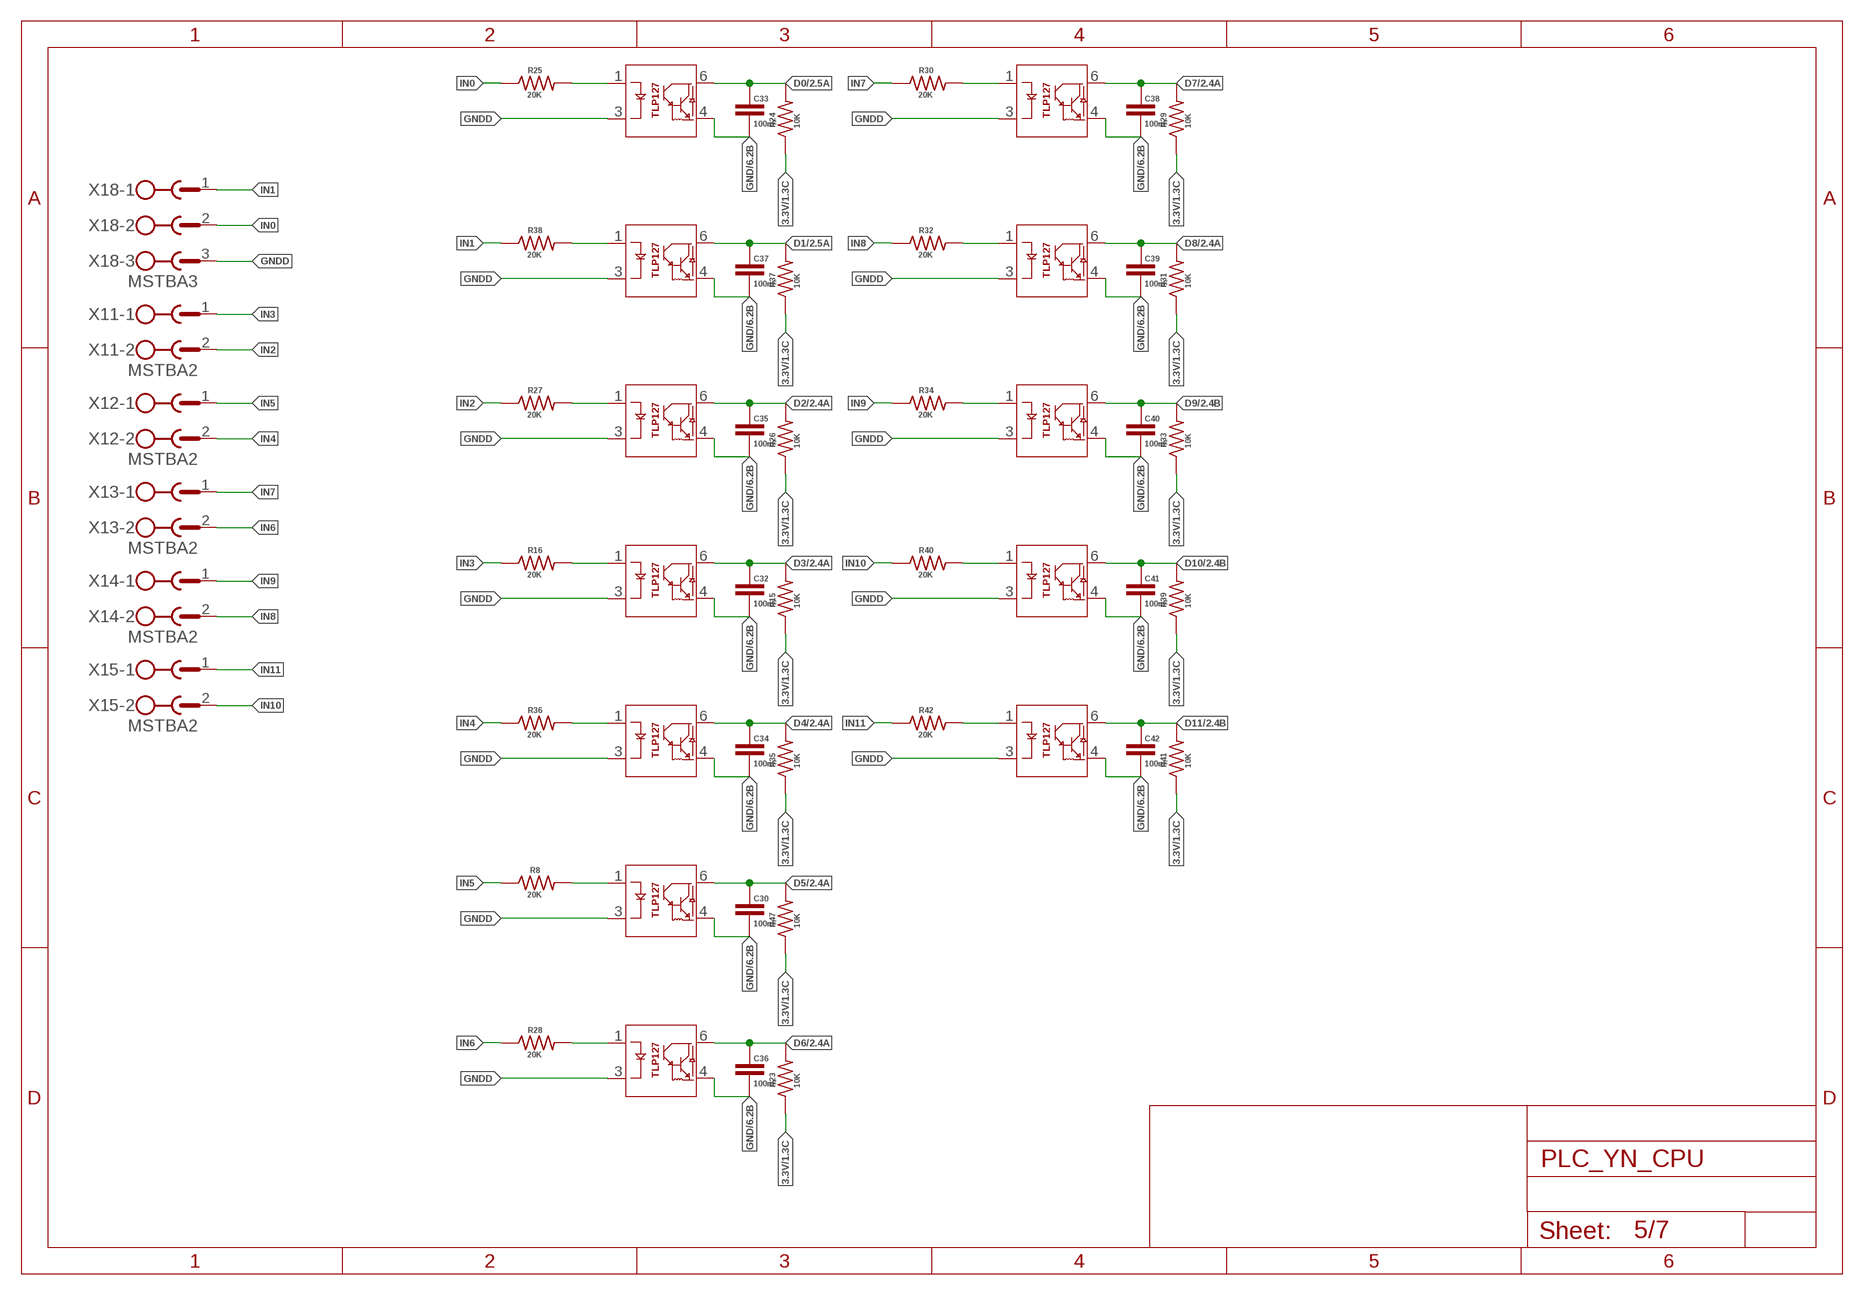
[diagram p5: schematic, sheet 5]

### Parts
C30  100nF  CAP_0603C0603  [C0603]
C32  100nF  CAP_0603C0603  [C0603]
C33  100nF  CAP_0603C0603  [C0603]
C34  100nF  CAP_0603C0603  [C0603]
C35  100nF  CAP_0603C0603  [C0603]
C36  100nF  CAP_0603C0603  [C0603]
C37  100nF  CAP_0603C0603  [C0603]
C38  100nF  CAP_0603C0603  [C0603]
C39  100nF  CAP_0603C0603  [C0603]
C40  100nF  CAP_0603C0603  [C0603]
C41  100nF  CAP_0603C0603  [C0603]
C42  100nF  CAP_0603C0603  [C0603]
R8  20K  RES_1206  [SMD_1206]
R15  10K  RES_0603R0603  [R0603]
R16  20K  RES_1206  [SMD_1206]
R23  10K  RES_0603R0603  [R0603]
R24  10K  RES_0603R0603  [R0603]
R25  20K  RES_1206  [SMD_1206]
R26  10K  RES_0603R0603  [R0603]
R27  20K  RES_1206  [SMD_1206]
R28  20K  RES_1206  [SMD_1206]
R29  10K  RES_0603R0603  [R0603]
R30  20K  RES_1206  [SMD_1206]
R31  10K  RES_0603R0603  [R0603]
R32  20K  RES_1206  [SMD_1206]
R33  10K  RES_0603R0603  [R0603]
R34  20K  RES_1206  [SMD_1206]
R35  10K  RES_0603R0603  [R0603]
R36  20K  RES_1206  [SMD_1206]
R37  10K  RES_0603R0603  [R0603]
R38  20K  RES_1206  [SMD_1206]
R39  10K  RES_0603R0603  [R0603]
R40  20K  RES_1206  [SMD_1206]
R41  10K  RES_0603R0603  [R0603]
R42  20K  RES_1206  [SMD_1206]
R47  10K  RES_0603R0603  [R0603]
U8  LTV-357T-B-IN  TLP127  [TLP127]
U10  LTV-357T-B-IN  TLP127  [TLP127]
U12  LTV-357T-B-IN  TLP127  [TLP127]
U13  LTV-357T-B-IN  TLP127  [TLP127]
U14  LTV-357T-B-IN  TLP127  [TLP127]
U15  LTV-357T-B-IN  TLP127  [TLP127]
U16  LTV-357T-B-IN  TLP127  [TLP127]
U17  LTV-357T-B-IN  TLP127  [TLP127]
U18  LTV-357T-B-IN  TLP127  [TLP127]
U19  LTV-357T-B-IN  TLP127  [TLP127]
U20  LTV-357T-B-IN  TLP127  [TLP127]
U23  LTV-357T-B-IN  TLP127  [TLP127]
X11  MSTBA2  [MSTBA2]
X12  MSTBA2  [MSTBA2]
X13  MSTBA2  [MSTBA2]
X14  MSTBA2  [MSTBA2]
X15  MSTBA2  [MSTBA2]
X18  MSTBA3  [MSTBA3]

### Nets
3.3V: R15.1 R23.1 R24.1 R26.1 R29.1 R31.1 R33.1 R35.1 R37.1 R39.1 R41.1 R47.1 ; also sheet 1,2
D0: C33.1 R24.2 U18.6 ; also sheet 2
D1: C37.1 R37.2 U23.6 ; also sheet 2
D2: C35.1 R26.2 U20.6 ; also sheet 2
D3: C32.1 R15.2 U14.6 ; also sheet 2
D4: C34.1 R35.2 U16.6 ; also sheet 2
D5: C30.1 R47.2 U8.6 ; also sheet 2
D6: C36.1 R23.2 U13.6 ; also sheet 2
D7: C38.1 R29.2 U10.6 ; also sheet 2
D8: C39.1 R31.2 U12.6 ; also sheet 2
D9: C40.1 R33.2 U15.6 ; also sheet 2
D10: C41.1 R39.2 U17.6 ; also sheet 2
D11: C42.1 R41.2 U19.6 ; also sheet 2
GND: C30.2 C32.2 C33.2 C34.2 C35.2 C36.2 C37.2 C38.2 C39.2 C40.2 C41.2 C42.2 U8.4 U10.4 U12.4 U13.4 U14.4 U15.4 U16.4 U17.4 U18.4 U19.4 U20.4 U23.4 ; also sheet 1,2,3,4,6,7
GNDD: U8.3 U10.3 U12.3 U13.3 U14.3 U15.3 U16.3 U17.3 U18.3 U19.3 U20.3 U23.3 X18.3
IN0: R25.1 X18.2
IN1: R38.1 X18.1
IN2: R27.1 X11.2
IN3: R16.1 X11.1
IN4: R36.1 X12.2
IN5: R8.1 X12.1
IN6: R28.1 X13.2
IN7: R30.1 X13.1
IN8: R32.1 X14.2
IN9: R34.1 X14.1
IN10: R40.1 X15.2
IN11: R42.1 X15.1
N$24: R30.2 U10.1
N$25: R16.2 U14.1
N$27: R32.2 U12.1
N$30: R34.2 U15.1
N$31: R25.2 U18.1
N$32: R40.2 U17.1
N$33: R27.2 U20.1
N$38: R42.2 U19.1
N$41: R8.2 U8.1
N$43: R28.2 U13.1
N$51: R38.2 U23.1
N$54: R36.2 U16.1

## Sheet 6 of 7: WIFI
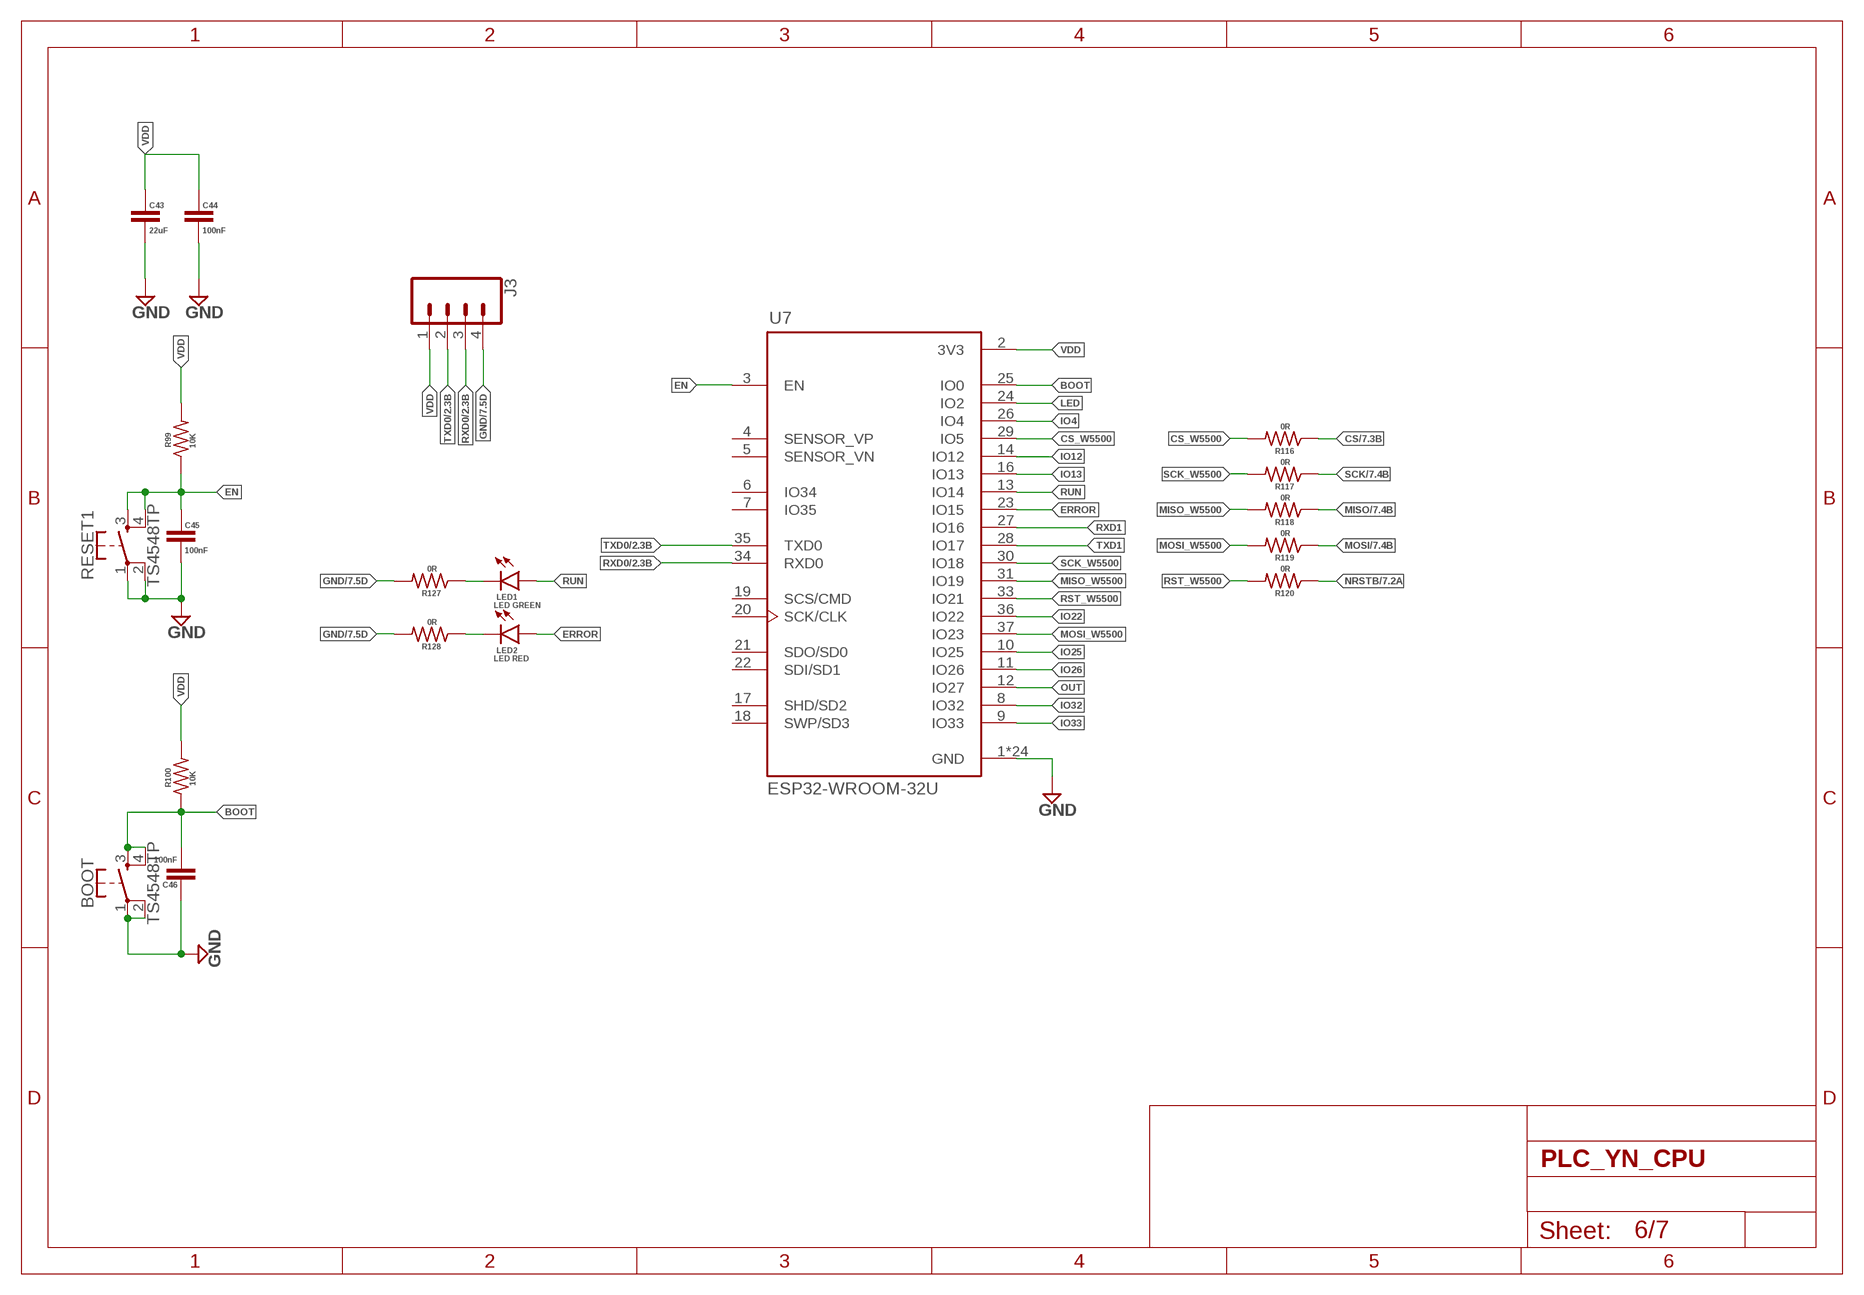
[diagram p6: schematic, sheet 6]

### Parts
BOOT  TS4548TP  PULSADOR-SMD-5.2MM  [SWITCH]
C43  22uF  CAP_0603C0603  [C0603]
C44  100nF  CAP_0603C0603  [C0603]
C45  100nF  CAP_0603C0603  [C0603]
C46  100nF  CAP_0603C0603  [C0603]
J3  CONN_04  [1X04]
LED1  LED GREEN  LEDSMT1206  [L1206]
LED2  LED RED  LEDSMT1206  [L1206]
R99  10K  RES_0603R0603  [R0603]
R100  10K  RES_0603R0603  [R0603]
R116  0R  RES_0603R0603  [R0603]
R117  0R  RES_0603R0603  [R0603]
R118  0R  RES_0603R0603  [R0603]
R119  0R  RES_0603R0603  [R0603]
R120  0R  RES_0603R0603  [R0603]
R127  0R  RES_0603R0603  [R0603]
R128  0R  RES_0603R0603  [R0603]
RESET1  TS4548TP  PULSADOR-SMD-5.2MM  [SWITCH]
U7  ESP32-WROOM-32U  ESP32-WROOM-32D  [MODULE_ESP32-WROOM-32D]

### Nets
BOOT: BOOT.3 BOOT.4 C46.2 R100.1 U7.25(IO0)
CS: R116.1 ; also sheet 7
CS_W5500: R116.2 U7.29(IO5)
EN: C45.1 R99.1 RESET1.3 RESET1.4 U7.3(EN)
ERROR: LED2.A U7.23(IO15)
GND: BOOT.1 BOOT.2 C43.2 C44.2 C45.2 C46.1 J3.4 R127.2 R128.2 RESET1.1 RESET1.2 U7.1(GND) U7.15(GND) U7.38(GND) U7.39_1(GND) U7.39_2(GND) U7.39_3(GND) U7.39_4(GND) U7.39_5(GND) U7.39_6(GND) U7.39_7(GND) U7.39_8(GND) U7.39_9(GND) U7.39_10(GND) U7.39_11(GND) U7.39_12(GND) U7.39_13(GND) U7.39_14(GND) U7.39_15(GND) U7.39_16(GND) U7.39_17(GND) U7.39_18(GND) U7.39_19(GND) U7.39_20(GND) U7.39_21(GND) ; also sheet 1,2,3,4,5,7
IO4: U7.26(IO4)
IO12: U7.14(IO12)
IO13: U7.16(IO13)
IO22: U7.36(IO22)
IO25: U7.10(IO25)
IO26: U7.11(IO26)
IO32: U7.8(IO32)
IO33: U7.9(IO33)
LED: U7.24(IO2)
MISO: R118.1 ; also sheet 7
MISO_W5500: R118.2 U7.31(IO19)
MOSI: R119.1 ; also sheet 7
MOSI_W5500: R119.2 U7.37(IO23)
N$59: LED1.C R127.1
N$60: LED2.C R128.1
NRSTB: R120.1 ; also sheet 7
OUT: U7.12(IO27)
RST_W5500: R120.2 U7.33(IO21)
RUN: LED1.A U7.13(IO14)
RXD0: J3.3 U7.34(RXD0) ; also sheet 2
RXD1: U7.27(IO16)
SCK: R117.1 ; also sheet 7
SCK_W5500: R117.2 U7.30(IO18)
TXD0: J3.2 U7.35(TXD0) ; also sheet 2
TXD1: U7.28(IO17)
VDD: C43.1 C44.1 J3.1 R99.2 R100.2 U7.2(3V3) ; also sheet 7
Unconnected: U7.4(SENSOR_VP) U7.5(SENSOR_VN) U7.6(IO34) U7.7(IO35) U7.17(SHD/SD2) U7.18(SWP/SD3) U7.19(SCS/CMD) U7.20(SCK/CLK) U7.21(SDO/SD0) U7.22(SDI/SD1)

## Sheet 7 of 7: ETHERNET
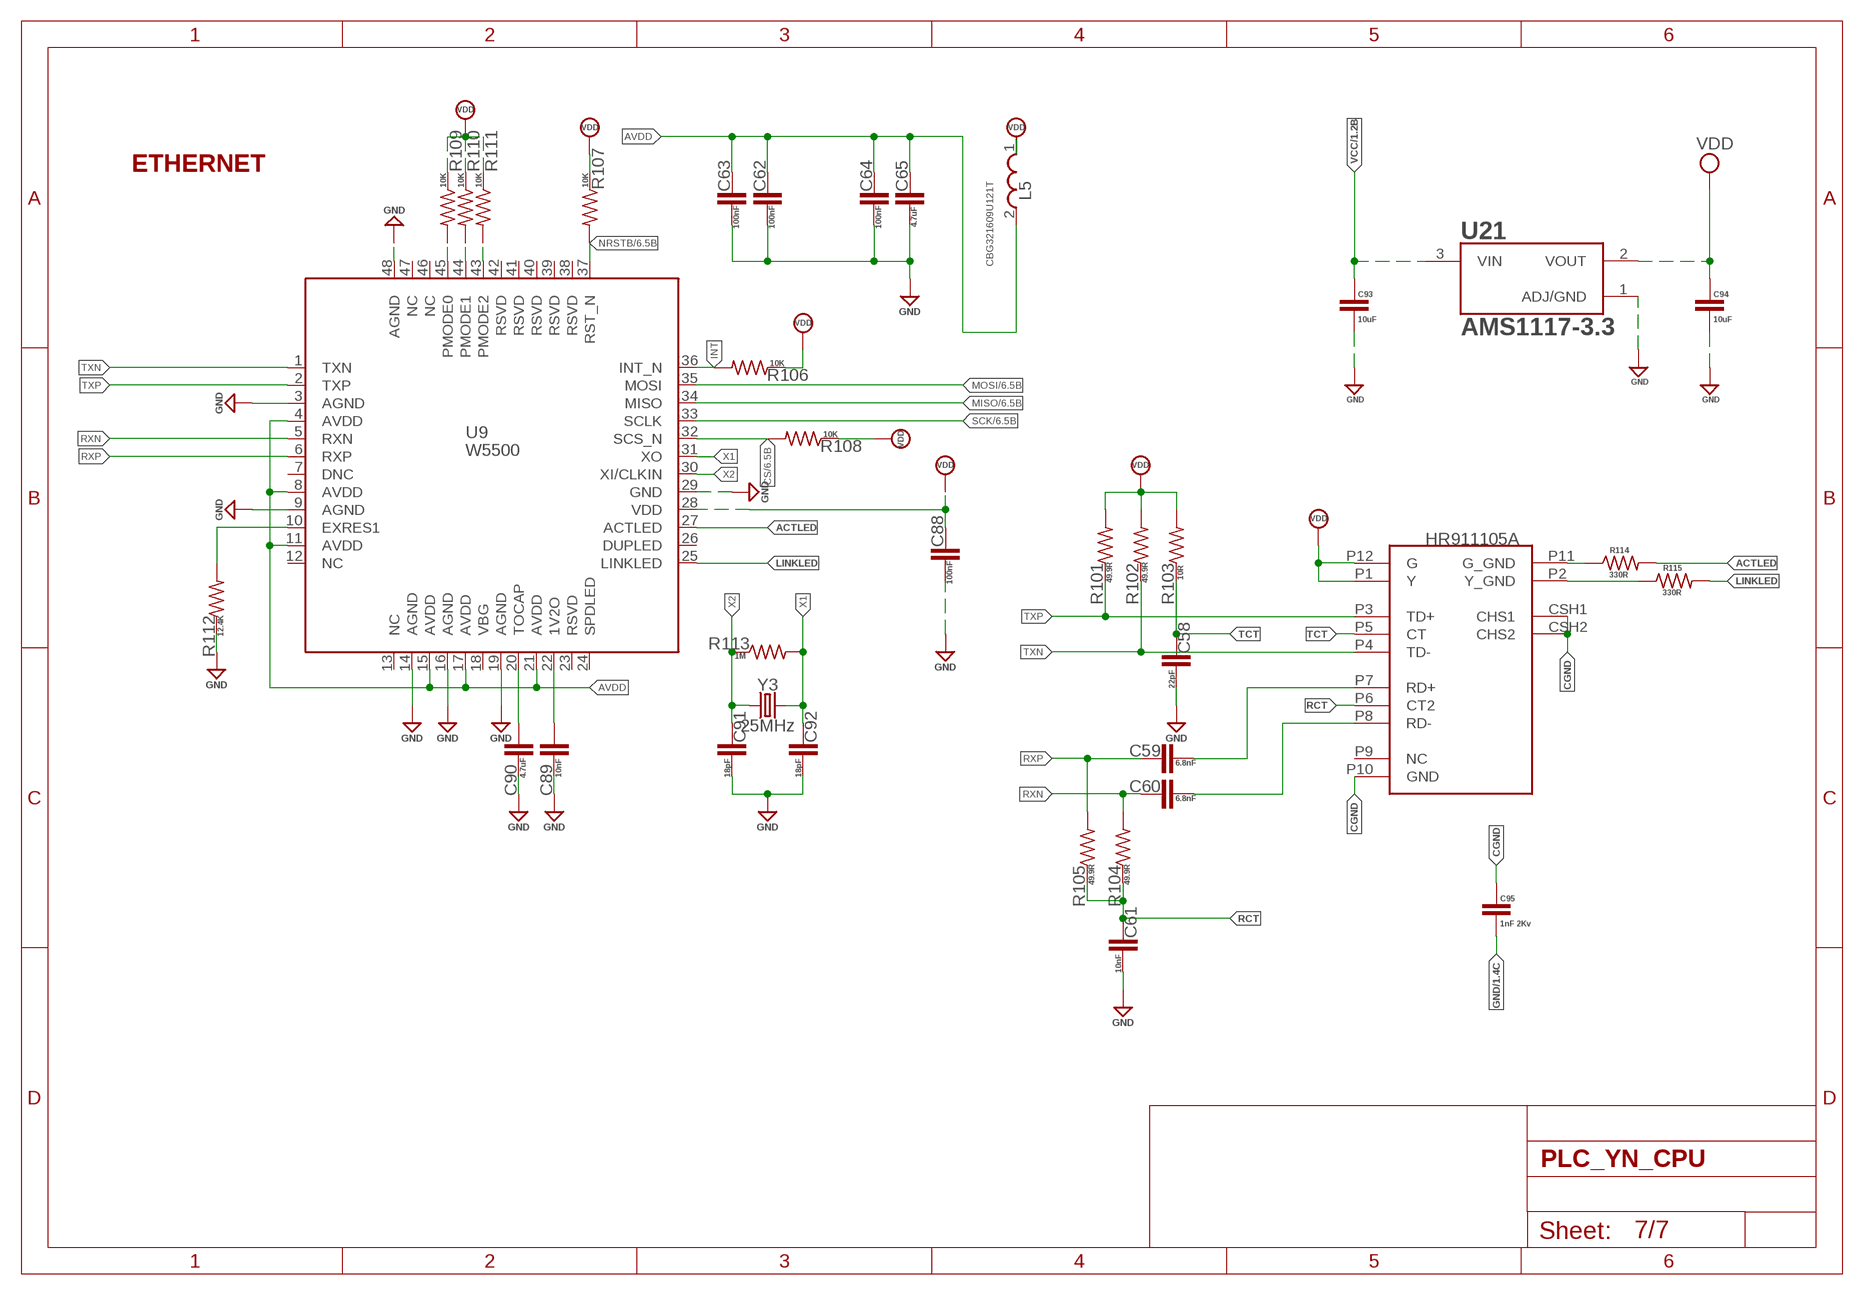
[diagram p7: schematic, sheet 7]

### Parts
C58  22pF  CAP_0603C0603  [C0603]
C59  6.8nF  CAP_0603C0603  [C0603]
C60  6.8nF  CAP_0603C0603  [C0603]
C61  10nF  CAP_0603C0603  [C0603]
C62  100nF  CAP_0603C0603  [C0603]
C63  100nF  CAP_0603C0603  [C0603]
C64  100nF  CAP_0603C0603  [C0603]
C65  4.7uF  CAP_0603C0603  [C0603]
C88  100nF  CAP_0603C0603  [C0603]
C89  10nF  CAP_0603C0603  [C0603]
C90  4.7uF  CAP_0603C0603  [C0603]
C91  18pF  CAP_0603C0603  [C0603]
C92  18pF  CAP_0603C0603  [C0603]
C93  10uF  CAP_1206  [SMD_1206]
C94  10uF  CAP_1206  [SMD_1206]
C95  1nF 2Kv  CAP_1206  [SMD_1206]
L5  CBG321609U121T  FERRITA_SMD_1206  [SMD_1206]
R101  49.9R  RES_0603R0603  [R0603]
R102  49.9R  RES_0603R0603  [R0603]
R103  10R  RES_0603R0603  [R0603]
R104  49.9R  RES_0603R0603  [R0603]
R105  49.9R  RES_0603R0603  [R0603]
R106  10K  RES_0603R0603  [R0603]
R107  10K  RES_0603R0603  [R0603]
R108  10K  RES_0603R0603  [R0603]
R109  10K  RES_0603R0603  [R0603]
R110  10K  RES_0603R0603  [R0603]
R111  10K  RES_0603R0603  [R0603]
R112  12.4K  RES_0603R0603  [R0603]
R113  1M  RES_0603R0603  [R0603]
R114  330R  RES_0603R0603  [R0603]
R115  330R  RES_0603R0603  [R0603]
U9  W5500  [W5500]
U21  AMS1117-3.3  [SOT229P700X180-4N]
X4  HR961160C  [HR961160C]
Y3  25MHz  CRYSTALSMD-HC49UP  [HC49UP]

### Nets
ACTLED: R114.2 U9.27(ACTLED)
AVDD: C62.1 C63.1 C64.1 C65.1 L5.2 U9.4(AVDD) U9.8(AVDD) U9.11(AVDD) U9.15(AVDD) U9.17(AVDD) U9.21(AVDD)
CGND: C95.1 X4.CSH1(CHS1) X4.CSH2(CHS2) X4.P10(GND)
CS: R108.2 U9.32(SCS_N) ; also sheet 6
GND: C58.2 C61.2 C62.2 C63.2 C64.2 C65.2 C88.2 C89.2 C90.2 C91.2 C92.2 C93.2 C94.2 C95.2 R112.1 U9.3(AGND) U9.9(AGND) U9.14(AGND) U9.16(AGND) U9.19(AGND) U9.29(GND) U9.48(AGND) U21.1(ADJ/GND) ; also sheet 1,2,3,4,5,6
INT: R106.2 U9.36(INT_N)
LINKLED: R115.2 U9.25(LINKLED)
MISO: U9.34(MISO) ; also sheet 6
MOSI: U9.35(MOSI) ; also sheet 6
N$61: C59.2 X4.P7(RD+)
N$62: C60.2 X4.P8(RD-)
N$63: R111.2 U9.43(PMODE2)
N$64: C89.1 U9.22(1V2O)
N$65: C90.1 U9.20(TOCAP)
N$66: R112.2 U9.10(EXRES1)
N$67: R109.2 U9.45(PMODE0)
N$68: R110.2 U9.44(PMODE1)
N$76: R114.1 X4.P11(G_GND)
N$77: R115.1 X4.P2(Y_GND)
NRSTB: R107.2 U9.37(RST_N) ; also sheet 6
RCT: C61.1 R104.1 R105.1 X4.P6(CT2)
RXN: C60.1 R104.2 U9.5(RXN)
RXP: C59.1 R105.2 U9.6(RXP)
SCK: U9.33(SCLK) ; also sheet 6
TCT: C58.1 R103.1 X4.P5(CT)
TXN: R102.1 U9.1(TXN) X4.P4(TD-)
TXP: R101.1 U9.2(TXP) X4.P3(TD+)
VCC: C93.1 U21.3(VIN) ; also sheet 1,2,3
VDD: C88.1 C94.1 L5.1 R101.2 R102.2 R103.2 R106.1 R107.1 R108.1 R109.1 R110.1 R111.1 U9.28(VDD) U21.2(VOUT) X4.P1(Y) X4.P12(G) ; also sheet 6
X1: C92.1 R113.2 U9.31(XO) Y3.2
X2: C91.1 R113.1 U9.30(XI/CLKIN) Y3.1
Unconnected: U9.7(DNC) U9.12(NC) U9.13(NC) U9.18(VBG) U9.23(RSVD) U9.24(SPDLED) U9.26(DUPLED) U9.38(RSVD) U9.39(RSVD) U9.40(RSVD) U9.41(RSVD) U9.42(RSVD) U9.46(NC) U9.47(NC) X4.P9(NC)

### Notes on the sheet
- ETHERNET

## Power pins joined to a net without a drawn wire
GND: U5.GND
VCC: U5.VCC

## Library data of the parts
BOOT RESET RESET1 = PROYECTO_SATELITAL:PULSADOR: Momentary Switch (Pushbutton) - SPST - Two Circuits Normally-open (NO) SPST momentary switches (buttons, pushbuttons). Schematic symbol includes two switch circuits.; PROD_ID: SWCH-08247; SF_SKU: COM-08720
BOOT0 = SparkFun-Connectors:CONN_02: Multi connection point. Often used as Generic Header-pin footprint for 0.1 inch spaced/style header connections On any of the 0.1 inch spaced packages, you can populate with these: Break Away Headers - Straight <https://www.sparkfun.com/products/116> (PRT-00116) Break Away Male Headers - Right Angle <https://www.sparkfun.com/products/553> (PRT-00553) Female Headers <https://www.sparkfun.com/products/115> (PRT-00115) Break Away Headers - Machine Pin <https://www.sparkfun.com/products/117> (PRT-00117) Break Away Female Headers - Swiss Machine Pin <https://www.sparkfun.com/products/743> (PRT-00743) For SCREWTERMINALS and SPRING TERMINALS visit here: Screw Terimnals on SparkFun.com <https://www.sparkfun.com/search/results?term=Screw+Terminals> (5mm/3.5mm/2.54mm spacing) This device is also useful as a general connection point to wire up your design to another part of your project. Our various solder wires solder well into these plated through hole pads. Hook-Up Wire - Assortment (Stranded, 22 AWG) <https://www.sparkfun.com/products/11375> (PRT-11375) Hook-Up Wire - Assortment (Solid Core, 22 AWG) <https://www.sparkfun.com/products/11367> (PRT-11367) View the entire wire category on our website here <https://www.sparkfun.com/categories/141> Special notes: Molex polarized connector foot print use with: PRT-08233 with associated crimp pins and housings. 2.54_SCREWTERM for use with PRT-10571. 3.5mm Screw Terminal footprints for PRT-08084 5mm Screw Terminal footprints for use with PRT-08432
BT1 = PROYECTO_SATELITAL:BATTERY: Battery - Single Cell A variety of battery chemistries, sizes, and footprints. Device List: 20MM_PTH - Coin Cell Battery Holder - 20mm (PTH) <https://www.sparkfun.com/products/783> 6.8MM_PTH - Coin Cell Battery Holder - 6.8MM(SMD) <https://www.digikey.com/product-detail/en/seiko-instruments/MS621FE-FL11E/728-1057-ND/1889208?WT.srch=1&gclid=CNOQ5a6LzdQCFZS2wAodXCkE0g> 12MM_SMD - Coin Cell Battery Holder - 12mm (SMD) <https://www.sparkfun.com/products/10592> 12MM_PTH - Coin Cell Battery Holder - 12mm (PTH) <https://www.sparkfun.com/products/7948> 20MM_SMD - 20mm Coin Cell Battery Holder (SMD) (2 legs) Used on the Big Time Watch Kit <https://www.sparkfun.com/products/11734> 20MM_SMD_4LEGS - Coin Cell Battery Holder - 20mm (SMD) <https://www.sparkfun.com/products/11892> 20MM_SMD_4LEGS_OVERPASTE - Coin Cell Battery Holder - 20mm (SMD) <https://www.sparkfun.com/products/11892> (Over-paste on the legs) 24.5MM_PTH - Coin Cell Battery Holder - 24.5mm (PTH) <https://www.sparkfun.com/products/8863> 9V - 9V Battery Holder - PC Mount Used on the SparkFun SparkPunk Sound Kit <https://www.sparkfun.com/products/11177> and SparkFun SparkPunk Sequencer Kit <https://www.sparkfun.com/products/12707> 18650 - Battery Holder - 18650 (PTH) <https://www.sparkfun.com/products/13113> AA - Battery Holder - 1xAA (PTH) <https://www.sparkfun.com/products/7949> AAA - Battery Holder - 1xAAA (PTH) <https://www.sparkfun.com/products/12718> AA_KIT - Battery Holder - 1xAA (PTH) <https://www.sparkfun.com/products/7949> Special kit package - pads only have exposed copper on one side of the board. AAA_KIT - Battery Holder - 1xAAA (PTH) <https://www.sparkfun.com/products/12718> Special kit package - pads only have exposed copper on one side of the board.
C1 = PROYECTO_SATELITAL:100UF_6.3X7.7_SMD
C2 C3 C5 C6 C8-C14 C16 C18-C28 C30-C92 = PROYECTO_SATELITAL:CAP_0603: CAPACITOR, European symbol; SPICEPREFIX: C
C4 C7 C15 C17 C93-C95 = PROYECTO_SATELITAL:CAP_1206: CAP_1206
C29 = PROYECTO_SATELITAL:470UF_10X10.2_SMD
D1-D3 D6 D7 = PROYECTO_SATELITAL:B360B-13-F: Diodes Inc B360B-13-F, SMT Schottky Diode, 60V 3A, 2-Pin DO-214AA Source: Datasheet <https://www.diodes.com/assets/Datasheets/ds30924.pdf>; ALLIED_NUMBER: 71028102; ALLIED_PRICE-STOCK: https://www.alliedelec.com/diodes-inc-b360b-13-f/71028102/; DESCRIPTION: Diodes Inc B360B-13-F, SMT Schottky Diode, 60V 3A, 2-Pin DO-214AA; HEIGHT: 2.5mm; MANUFACTURER_NAME: Diodes Inc.; MANUFACTURER_PART_NUMBER: B360B-13-F; MOUSER_PART_NUMBER: 621-B360B-F; MOUSER_PRICE-STOCK: https://www.mouser.com/Search/Refine.aspx?Keyword=621-B360B-F; RS_PART_NUMBER: 7513288P; RS_PRICE-STOCK: http://uk.rs-online.com/web/p/products/7513288P
D4 D9 D11 D13 D15 D25 D27 D29 D31 D33 D35 D37 D39 D41 D43 D45 = PROYECTO_SAT_PINES:1N4148W-13-F: Diode Switching 100V 0.15A 2Pin SOD123 Diodes Inc 1N4148W-13-F Switching Diode, 300mA 100V, 2-Pin SOD-123 Source: Datasheet <http://docs-emea.rs-online.com/webdocs/13d1/0900766b813d199a.pdf>; ARROW_PART_NUMBER: 1N4148W-13-F; ARROW_PRICE-STOCK: https://www.arrow.com/en/products/1n4148w-13-f/diodes-incorporated; DESCRIPTION: Diode Switching 100V 0.15A 2Pin SOD123 Diodes Inc 1N4148W-13-F Switching Diode, 300mA 100V, 2-Pin SOD-123; HEIGHT: 1.45mm; MANUFACTURER_NAME: Diodes Inc.; MANUFACTURER_PART_NUMBER: 1N4148W-13-F; MOUSER_PART_NUMBER: 621-1N4148W-13-F; MOUSER_PRICE-STOCK: https://www.mouser.co.uk/ProductDetail/Diodes-Incorporated/1N4148W-13-F?qs=rGAXPo9uwV24ebUy2vYvsA%3D%3D
D5 D10 D12 D14 D16 D26 D28 D30 D32 D34 D36 D38 D40 D42 D44 D46 ERROR LED1 LED2 OK = PROYECTO_SATELITAL:LED: LED
F2 = PROYECTO_SAT_PINES:PORTAFUSIBLE
FL1 = PROYECTO_SATELITAL:BNX022-01L: LC EMI Filter 5th Order Low Pass 2 Channel C = 47µF 20A 4-SMD, J-Lead Check availability <https://pricing.snapeda.com/parts/BNX022-01L/Murata%20Electronics/view-part?ref=eda>; AVAILABILITY: In Stock; DESCRIPTION: LC EMI Filter 5th Order Low Pass 2 Channel C = 1µF 20 A 4-SMD, No Lead; MF: Murata Electronics; MP: BNX022-01L; PACKAGE: SMD-4 Murata Electronics; PRICE: None; PURCHASE-URL: https://pricing.snapeda.com/search/part/BNX022-01L/?ref=eda
IC1 = PROYECTO_SATELITAL:LM2596: SIMPLE SWITCHER® Power Converter 150 kHz 3A Step-Down Voltage Regulator Source: http://www.national.com/ds/LM/LM2596.pdf; MF: NATIONAL SEMICONDUCTOR; MPN: LM2596S-ADJ/NOPB; OC_FARNELL: 9494367; OC_NEWARK: 41K3842
IC3 = PROYECTO_SATELITAL:EEPROM-I2C: I2C EEPROMs, 24LC256 and others 24LC256 Series 256 kb I2C 2 Wire (32 k x 8 Bit) 2.5 V Serial EEPROM SMD - SOIC-8 Datasheet SparkFun Products SparkFun UDB5 - PIC UAV Development Board <https://www.sparkfun.com/products/11703> (GPS-11703); PROD_ID: IC-09714; VALUE: 24LC256
J1 J3 = SparkFun-Connectors:CONN_04: Multi connection point. Often used as Generic Header-pin footprint for 0.1 inch spaced/style header connections On any of the 0.1 inch spaced packages, you can populate with these: Break Away Headers - Straight <https://www.sparkfun.com/products/116> (PRT-00116) Break Away Male Headers - Right Angle <https://www.sparkfun.com/products/553> (PRT-00553) Female Headers <https://www.sparkfun.com/products/115> (PRT-00115) Break Away Headers - Machine Pin <https://www.sparkfun.com/products/117> (PRT-00117) Break Away Female Headers - Swiss Machine Pin <https://www.sparkfun.com/products/743> (PRT-00743) For SCREWTERMINALS and SPRING TERMINALS visit here: Screw Terimnals on SparkFun.com <https://www.sparkfun.com/search/results?term=Screw+Terminals> (5mm/3.5mm/2.54mm spacing) This device is also useful as a general connection point to wire up your design to another part of your project. Our various solder wires solder well into these plated through hole pads. Hook-Up Wire - Assortment (Stranded, 22 AWG) <https://www.sparkfun.com/products/11375> (PRT-11375) Hook-Up Wire - Assortment (Solid Core, 22 AWG) <https://www.sparkfun.com/products/11367> (PRT-11367) View the entire wire category on our website here <https://www.sparkfun.com/categories/141> Special notes: Molex polarized connector foot print use with SKU : PRT-08231 with associated crimp pins and housings. 1MM SMD Version SKU: PRT-10208; PROD_ID: CONN-09696
J2 = PROYECTO_SATELITAL:USB_MINI-B: USB type Mini-B Connector Breaks out 5th pin, and includes shield pins if needed. SparkFun Products: SparkFun FTDI Basic Breakout <https://www.sparkfun.com/products/9716> SparkFun XBee Explorer USB <https://www.sparkfun.com/products/11812> SparkFun Redboard <https://www.sparkfun.com/products/12757>; PROD_ID: CONN-08193; SF_ID: PRT-00587
L1 = PROYECTO_SATELITAL:INDUCTOR_SMD: INDUCTOR SMD
L2-L5 = PROYECTO_SATELITAL:FERRITA_SMD_1206: FERRITA 1206 SMD
R1-R7 R9-R15 R17-R24 R26 R29 R31 R33 R35 R37 R39 R41 R43-R120 R127 R128 = PROYECTO_SATELITAL:RES_0603: RESISTOR, American symbol; SPICEPREFIX: R
R8 R16 R25 R27 R28 R30 R32 R34 R36 R38 R40 R42 = PROYECTO_SATELITAL:RES_1206
RL1 RL3-RL6 RL11-RL21 = PROYECTO_SATELITAL:HF41F
S2 = switch-dil:219-02*: Surface Mount DIP Switch Series 219 SMT CTS Electronic Components Sourc: www.ctscorp.com; OC_FARNELL: unknown; OC_NEWARK: unknown
U1 U21 = PROYECTO_SATELITAL:AMS1117-3.3: Sot223/Pkg 1-Amp 3.3-Volt Low Drop Out Voltage Regulatator Check availability <https://pricing.snapeda.com/parts/AMS1117-3.3/Advanced%20Monolithic%20Systems/view-part?ref=eda>; AVAILABILITY: In Stock; DESCRIPTION: Sot223/Pkg 1-Amp 3.3-Volt Low Drop Out Voltage Regulatator; MF: Advanced Monolithic Systems; MP: AMS1117-3.3; PACKAGE: SOT-223 Seeed Technology; PRICE: None
U2 = PROYECTO_SATELITAL:STM32F407VGT6: STM32 Series 32-bit 1 MB Flash 192 kB RAM ARM Based Microcontroller - LQFP-100 Check availability <https://pricing.snapeda.com/parts/STM32F407VGT6/STMicroelectronics/view-part?ref=eda>; AVAILABILITY: In Stock; DESCRIPTION: ARM® Cortex®-M4 series Microcontroller IC 32-Bit Single-Core 168MHz 1MB (1M x 8) FLASH 100-LQFP (14x14); MF: STMicroelectronics; MP: STM32F407VGT6; PACKAGE: LQFP-100 STMicroelectronics; PRICE: None; PURCHASE-URL: https://pricing.snapeda.com/search/part/STM32F407VGT6/?ref=eda
U3 U4 = PROYECTO_SATELITAL:MAX232: Dual EIA-232 driver and receiver 16-SOIC -40 to 85 Check availability <https://pricing.snapeda.com/parts/MAX232IDR/Texas%20Instruments/view-part?ref=eda>; AVAILABILITY: In Stock; DESCRIPTION: 5-V dual channel 120kbps RS-232 line driver/receiver with +/-9V output & +/-2-kV ESD protection; MF: Texas Instruments; MP: MAX232IDR; PACKAGE: SOIC-16 Texas Instruments; PRICE: None; PURCHASE-URL: https://pricing.snapeda.com/search/part/MAX232IDR/?ref=eda
U5 = PROYECTO_SATELITAL:RS485TTL
U6 U11 = PROYECTO_SATELITAL:ULN2803ADW: Check prices <https://pricing.snapeda.com/parts/ULN2803ADW/Texas%20Instruments/view-part?ref=eda>; AVAILABILITY: In Stock; DESCRIPTION: 50-V, 8-ch darlington array 18-SOIC -40 to 85; MF: Texas Instruments; MP: ULN2803ADW; PACKAGE: SOIC-18 Texas Instruments; PRICE: None; PURCHASE-URL: https://pricing.snapeda.com/search/part/ULN2803ADW/?ref=eda
U7 = PROYECTO_SATELITAL:ESP32-WROOM-32D: Bluetooth, WiFi 802.11b/g/n, Bluetooth v4.2 + EDR, Class 1, 2 and 3 Transceiver Module 2.4GHz ~ 2.5GHz Integrated, Trace Surface Mount Check availability <https://pricing.snapeda.com/parts/ESP32-WROOM-32D/Espressif%20Systems/view-part?ref=eda>; AVAILABILITY: In Stock; DESCRIPTION: Bluetooth, WiFi 802.11b/g/n, Bluetooth v4.2 +EDR, Class 1, 2 and 3 Transceiver Module 2.4GHz ~ 2.5GHz Integrated; MF: Espressif Systems; MP: ESP32-WROOM-32D; PACKAGE: Module Espressif Systems; PRICE: None; PURCHASE-URL: https://pricing.snapeda.com/search/part/ESP32-WROOM-32D/?ref=eda
U8 U10 U12-U20 U23 = PROYECTO_SATELITAL:TLP127
U9 = PROYECTO_SATELITAL:W5500: WIZNET W5500
X1 X2 X5-X15 X17 X19-X23 = PROYECTO_SAT_PINES:MSTBA2: PHOENIX; MF: FARNELL; MPN: 1757242; OC_FARNELL: 3705171; OC_NEWARK: 71C4161
X3 X18 = PROYECTO_SAT_PINES:MSTBA3: PHOENIX; MF: FARNELL; MPN: 1757255; OC_FARNELL: 3705183; OC_NEWARK: 71C4162
X4 = PROYECTO_SATELITAL:HR961160C
Y1-Y3 = PROYECTO_SATELITAL:CRYSTAL: Crystals (Generic) These are passive quartz crystals, which can be used as a clock source for a microcontroller. Crystal's are two-terminal devices. They require external "load" capacitors to generate an oscillating signal.